# EasyEDA Pro project sucaiku.eprj

# Schematic Schematic1

## Sheets
1 POWER: Board Name: Board1; Create Date: 2025-07-08; Page Name: POWER; Project Name: sucaiku-20250721; Schematic Name: Schematic1; Update Date: 2025-07-08; Company: 嘉立创EDA; Page Size: A4; Version: V1.0
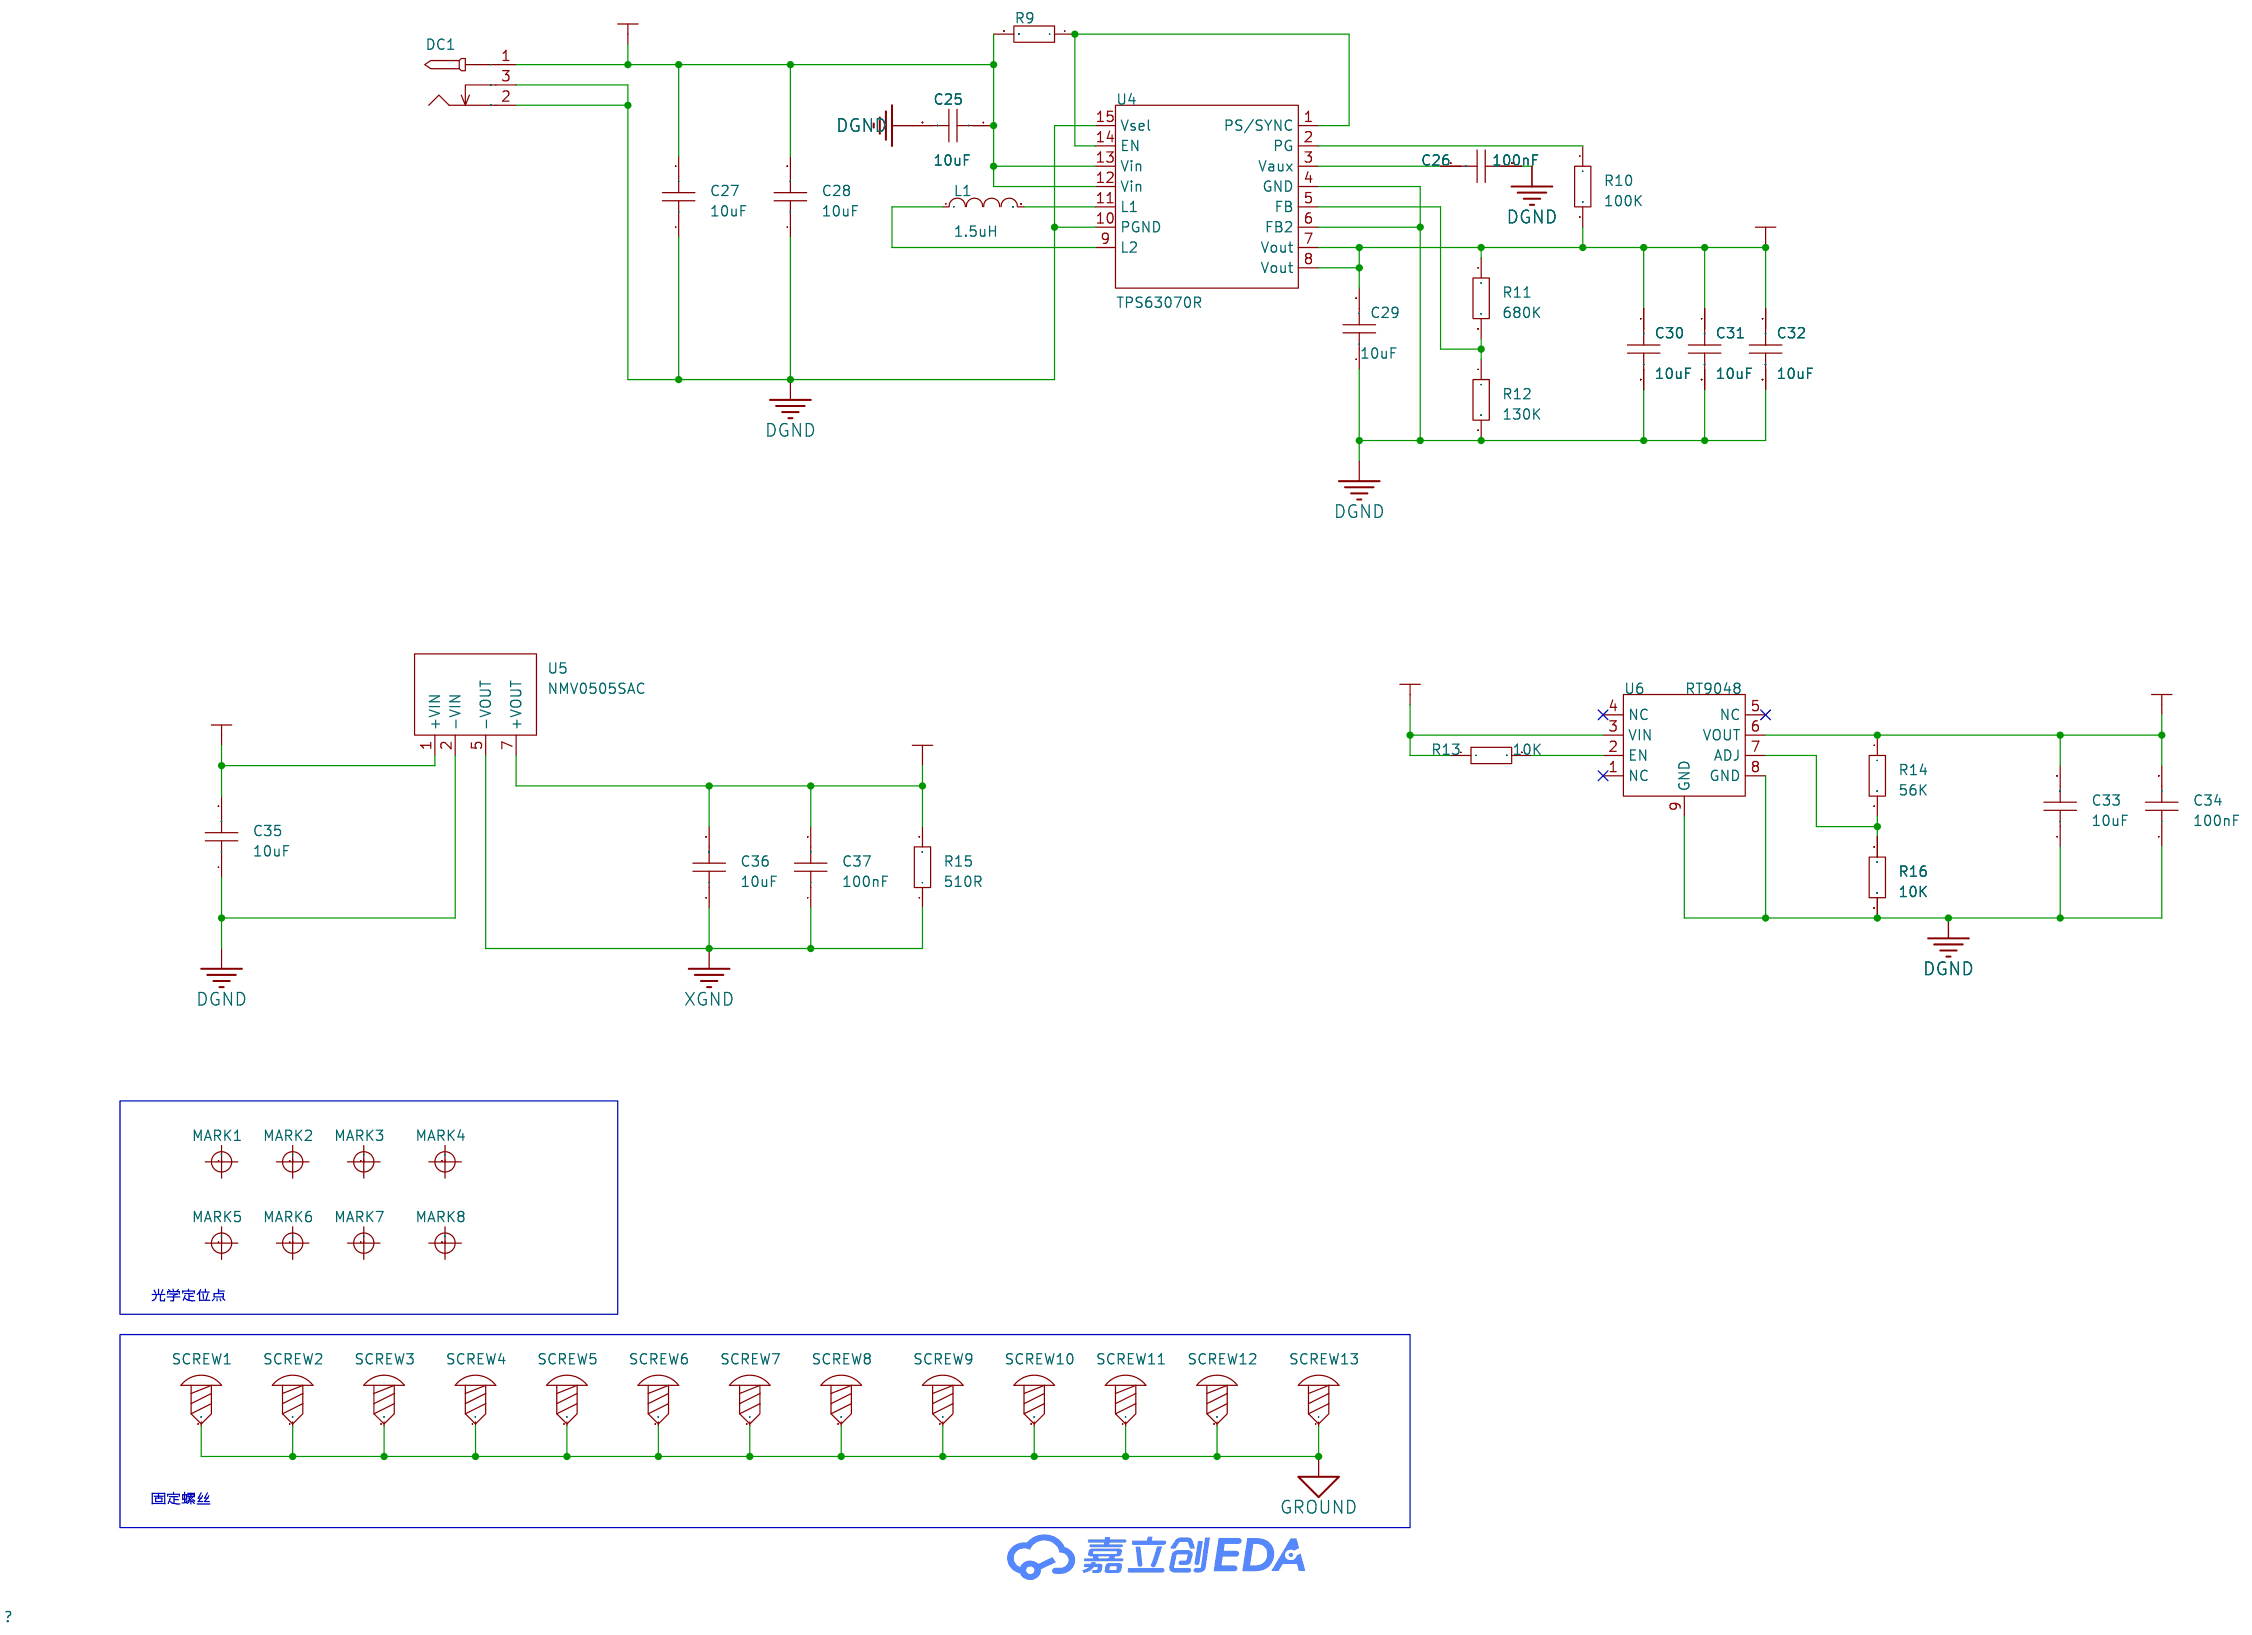
[diagram p0: POWER]
2 MCU: Page Name: MCU; Update Date: 2025-07-21
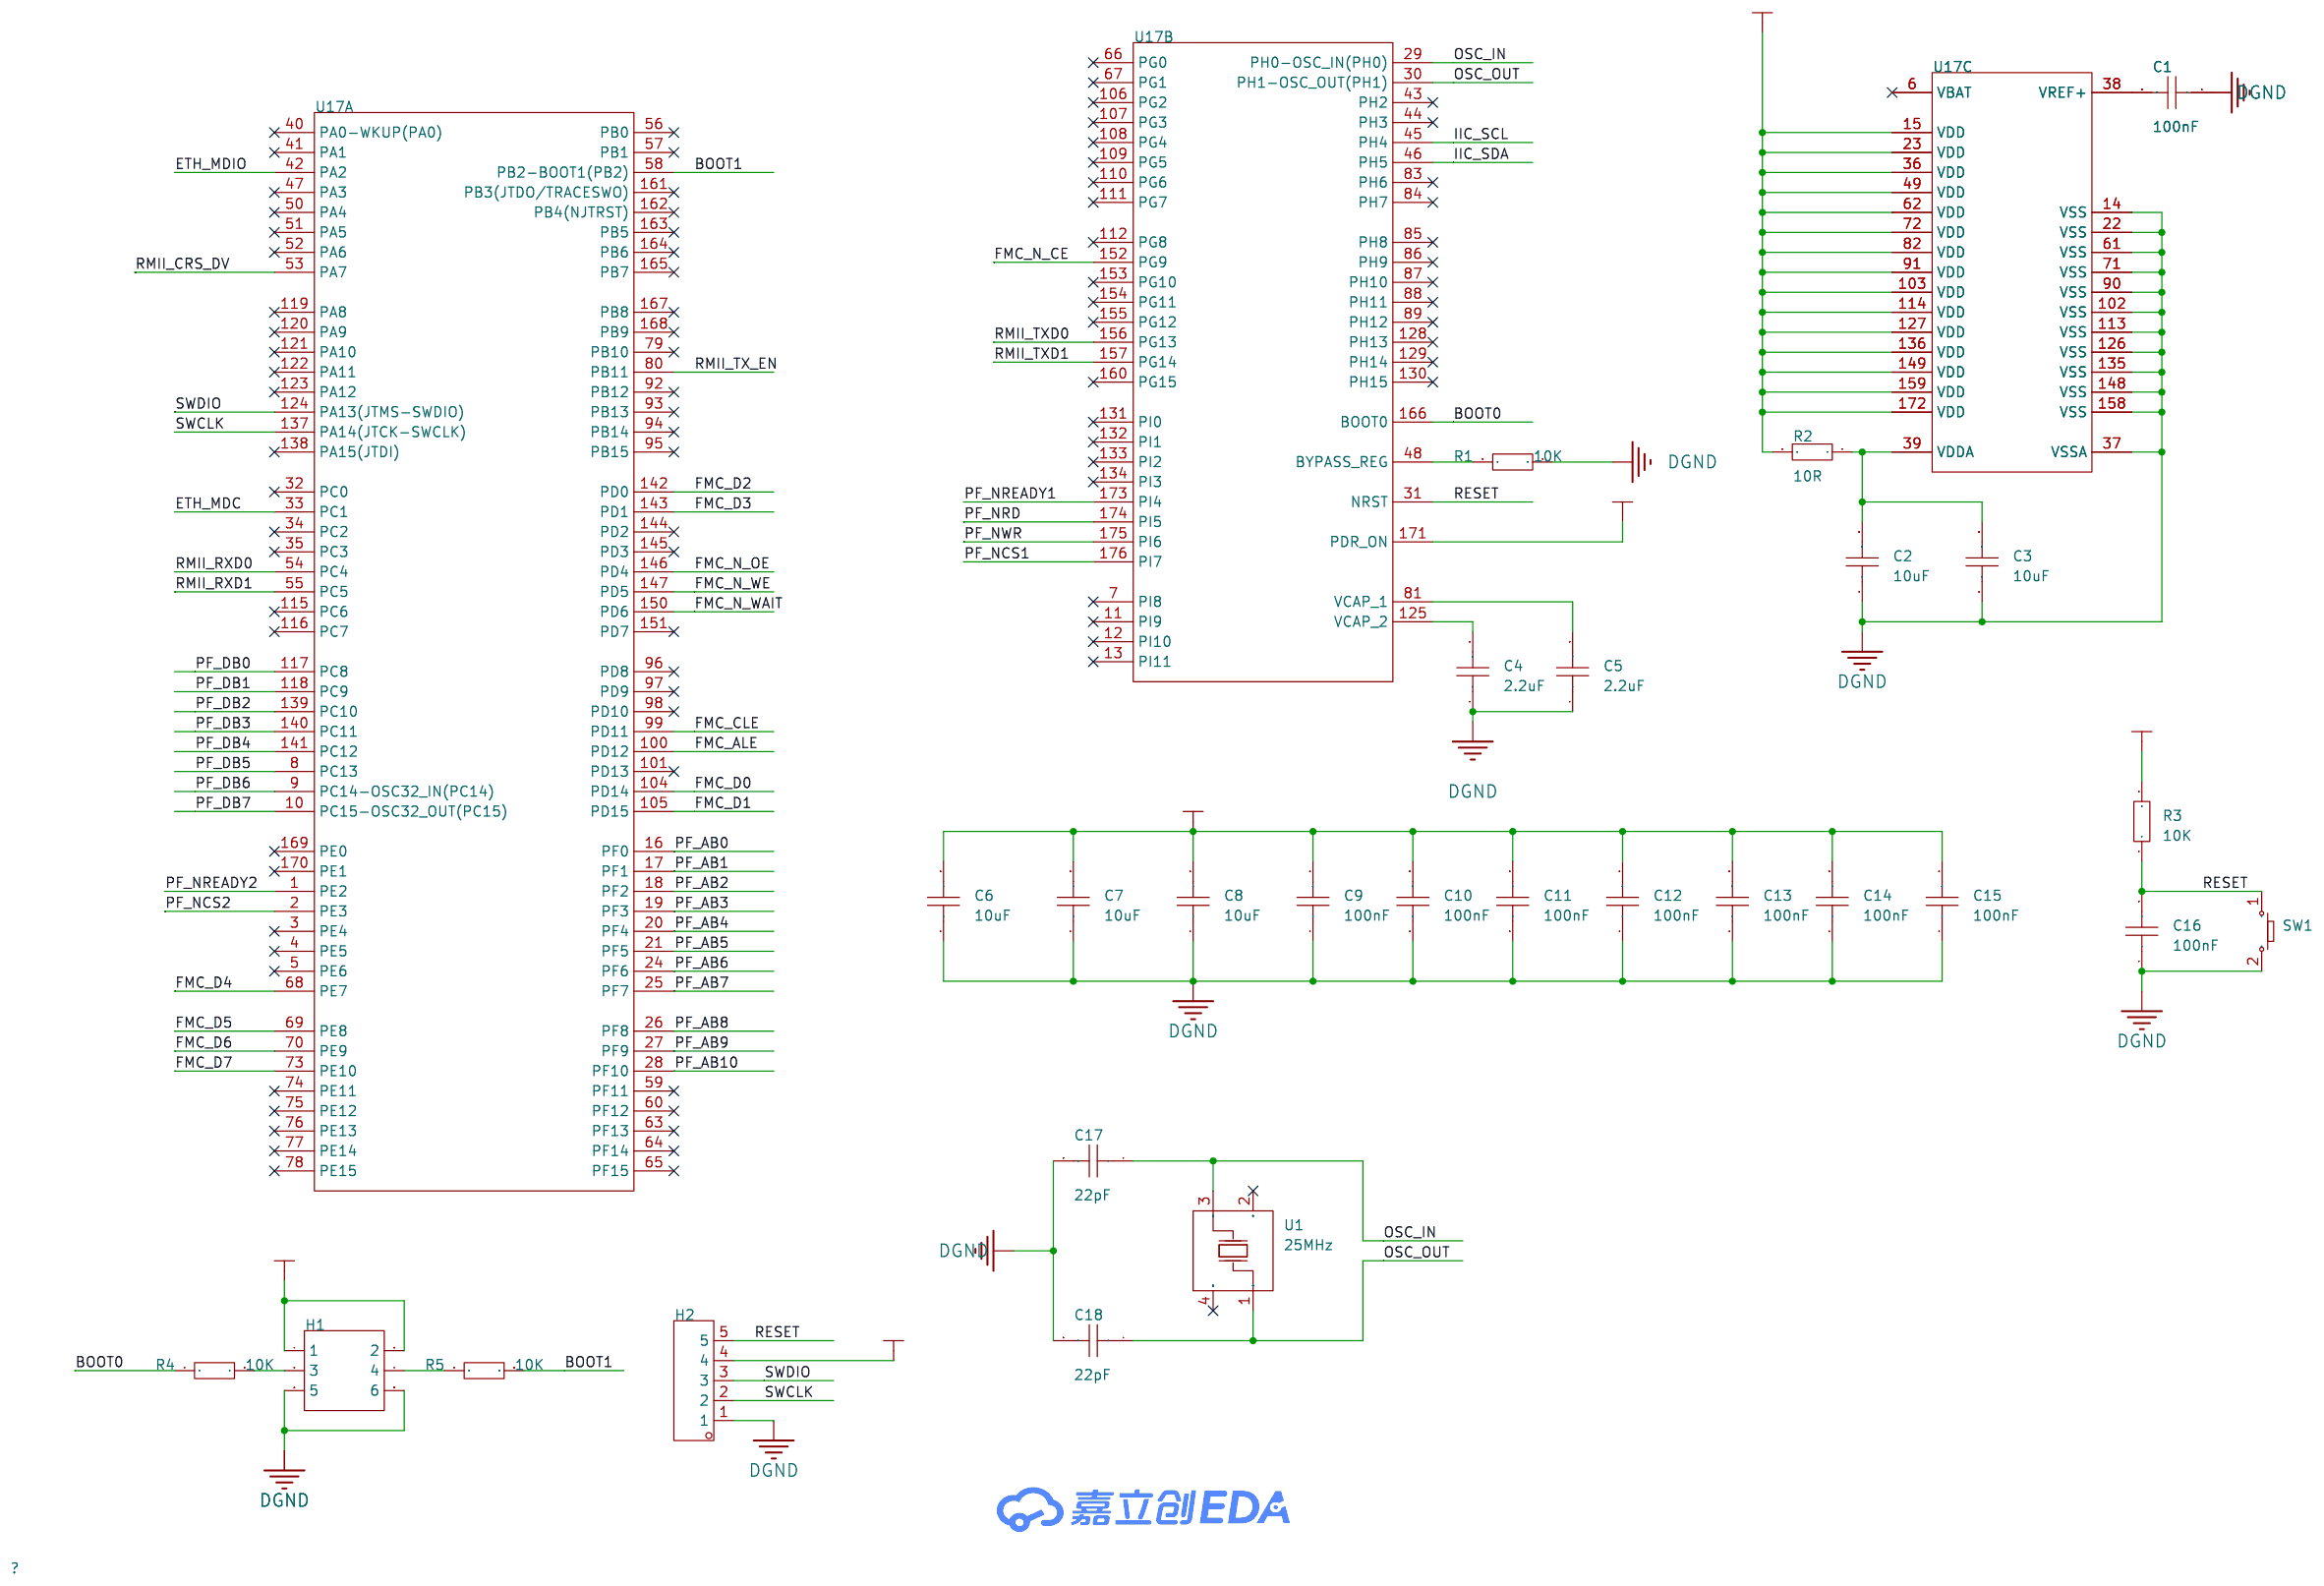
[diagram p1: MCU]
3 PROFIBUS1: Page Name: PROFIBUS1; Update Date: 2025-07-21
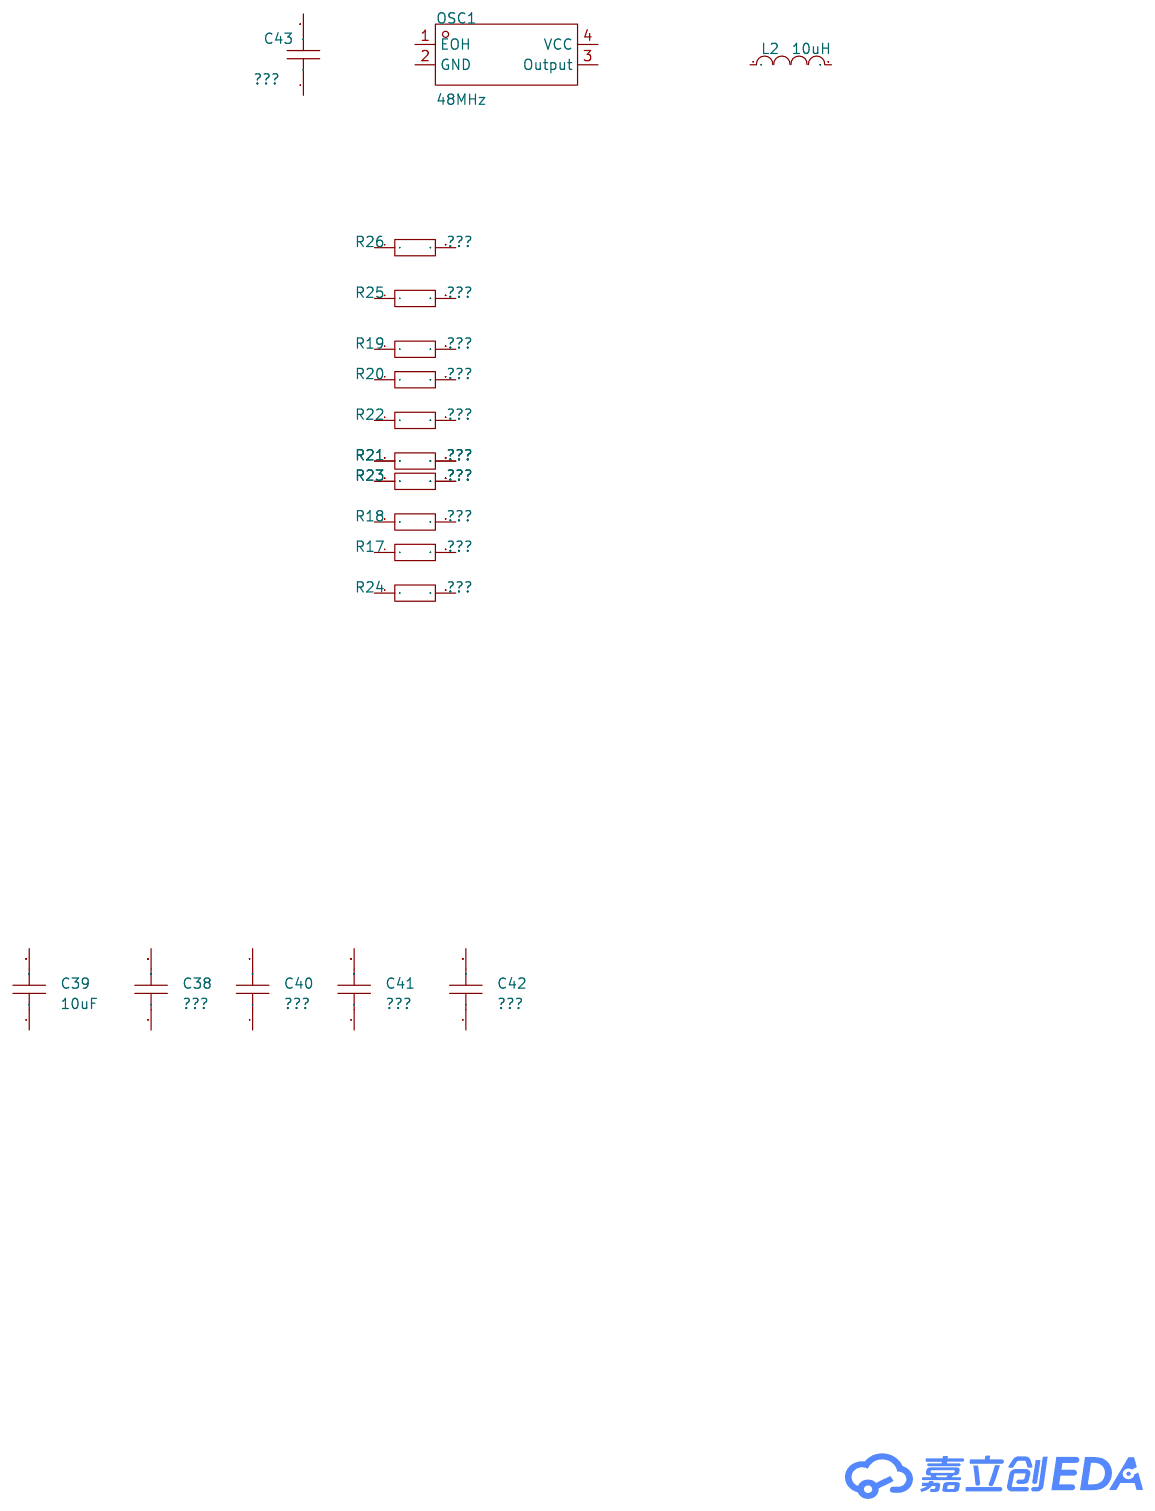
[diagram p2: PROFIBUS1]
4 ETHERNET: Page Name: ETHERNET
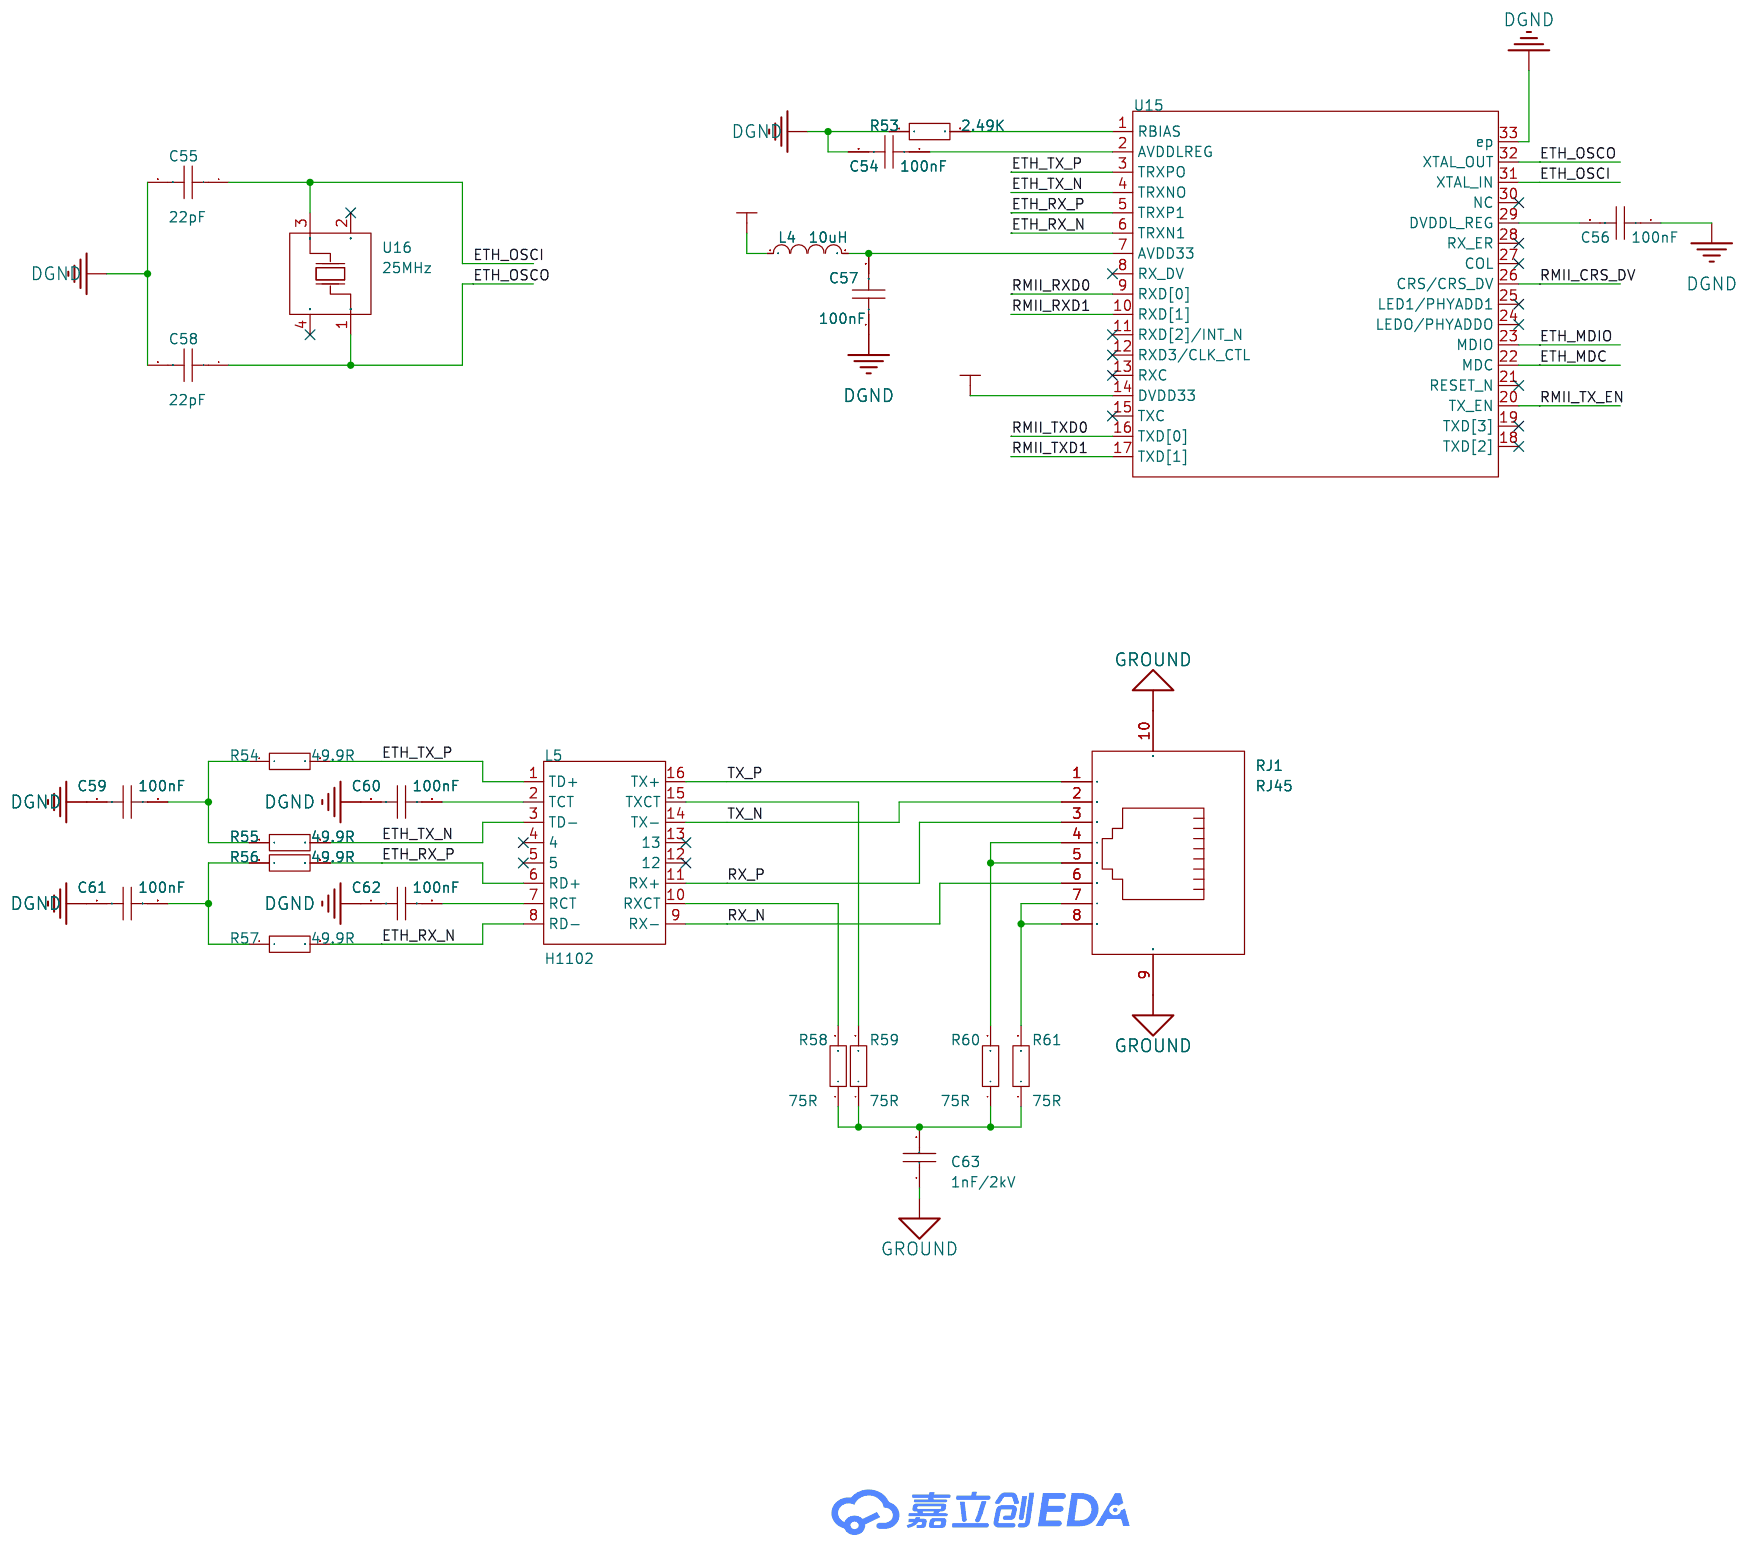
[diagram p3: ETHERNET]
5 MEMORY: Page Name: MEMORY
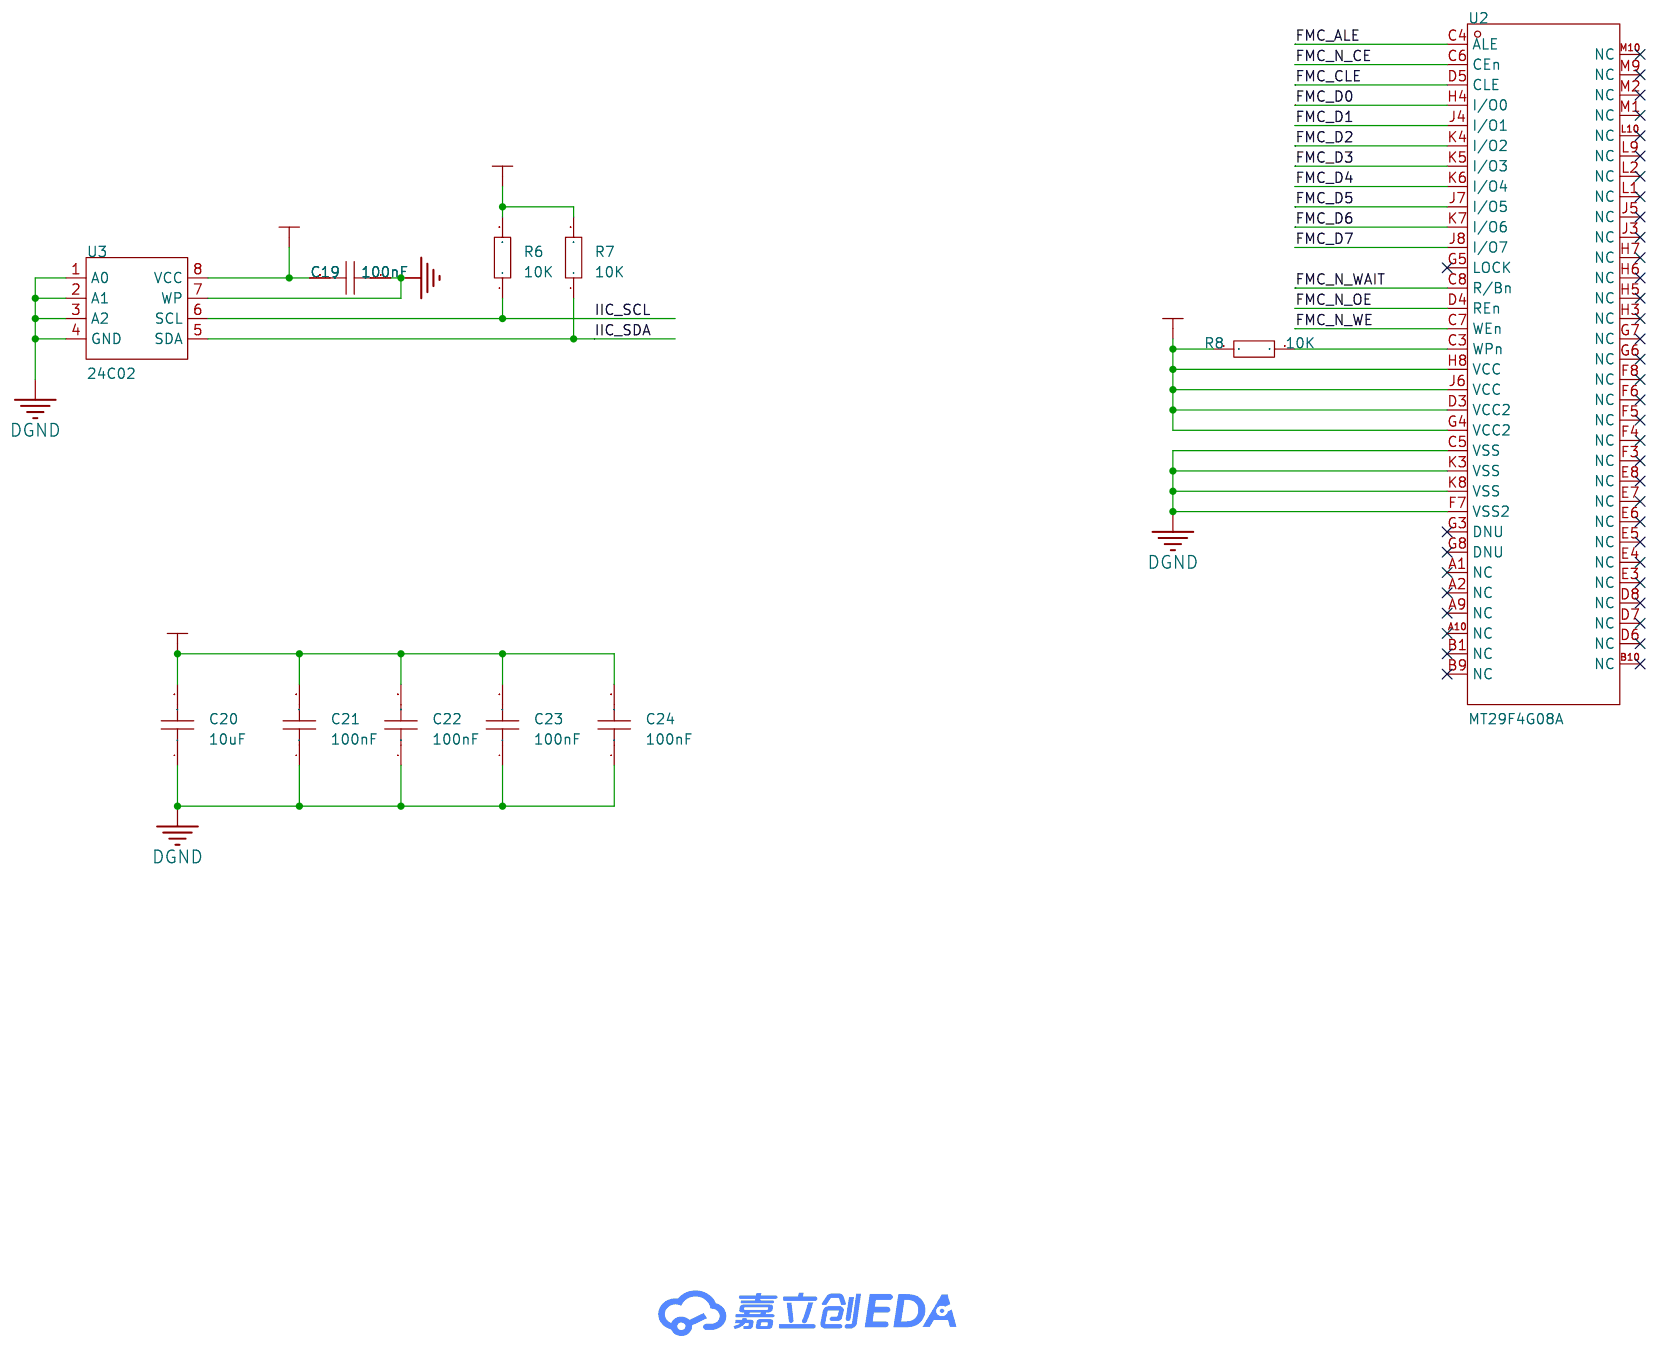
[diagram p4: MEMORY]
6 PROFIBUS2: Page Name: PROFIBUS2
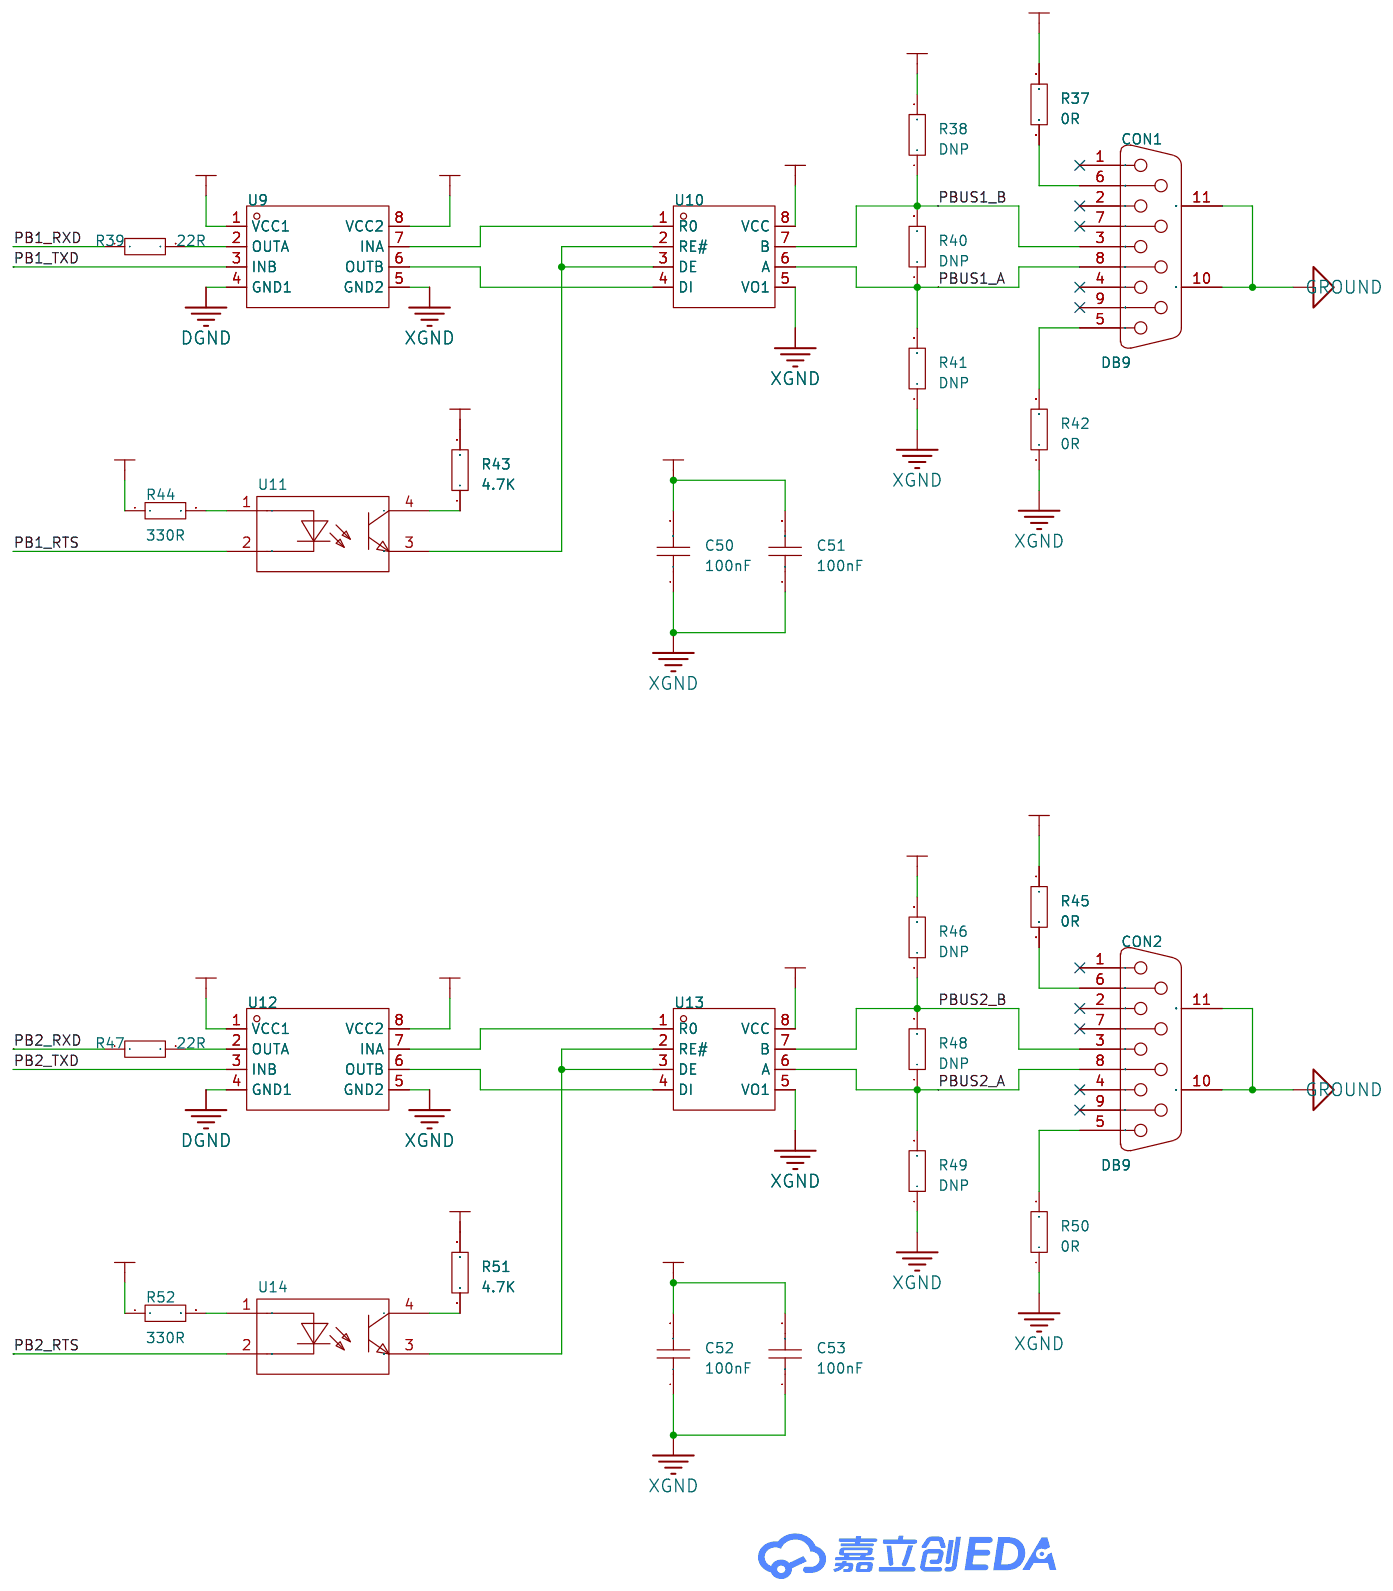
[diagram p5: PROFIBUS2]

## Parts
sheet ETHERNET
C54  100nF  [C0402]
C55  22pF  [C0402]
C56  100nF  [C0402]
C57  100nF  [C0402]
C58  22pF  [C0402]
C59  100nF  [C0603]
C60  100nF  [C0603]
C61  100nF  [C0603]
C62  100nF  [C0603]
C63  1nF/2kV  [C1206]
L4  10uH  [L0402]
L5  H1102  [XFMR-SMD_H1102N]
R53  2.49K  [R0603]
R54  49.9R  [R0603]
R55  49.9R  [R0603]
R56  49.9R  [R0603]
R57  49.9R  [R0603]
R58  75R  [R0603]
R59  75R  [R0603]
R60  75R  [R0603]
R61  75R  [R0603]
RJ1  RJ45  [RJ45-TH_R-RJ45R10P-B000-1]
U15  YT8512C  [QFN-32_L5.0-W5.0-P0.50-BL-EP3.4]
U16  25MHz  [CRYSTAL-SMD_4P-L3.2-W2.5-TR]
sheet MCU
C1  100nF  [C0402]
C2  10uF  [C0603]
C3  10uF  [C0603]
C4  2.2uF  [C0402]
C5  2.2uF  [C0402]
C6  10uF  [C0603]
C7  10uF  [C0603]
C8  10uF  [C0603]
C9  100nF  [C0402]
C10  100nF  [C0402]
C11  100nF  [C0402]
C12  100nF  [C0402]
C13  100nF  [C0402]
C14  100nF  [C0402]
C15  100nF  [C0402]
C16  100nF  [C0402]
C17  22pF  [C0402]
C18  22pF  [C0402]
H1  -  [HDR-TH_6P-P2.54-V-R2-C3-S2.54_A2541WV-2X3P]
H2  -  [HDR-TH_5P-P2.54-V-M]
R1  10K  [R0402]
R2  10R  [R0402]
R3  10K  [R0402]
R4  10K  [R0402]
R5  10K  [R0402]
SW1  -  [Key_SMD_3x4x2]
U1  25MHz  [CRYSTAL-SMD_4P-L3.2-W2.5-TR]
U17  STM32F429IGT6  [LQFP-176_L24.0-W24.0-P0.50-LS26.0-BL]  (sections 1,2,3)
sheet MEMORY
C19  100nF  [C0402]
C20  10uF  [C0603]
C21  100nF  [C0402]
C22  100nF  [C0402]
C23  100nF  [C0402]
C24  100nF  [C0402]
R6  10K  [R0402]
R7  10K  [R0402]
R8  10K  [R0402]
U2  MT29F4G08A  [VFBGA-63_L11.0-W9.0-P0.80-BL_MT29F2G08ABAEAH4-IT-E]
U3  24C02  [SOP-8_L4.9-W3.9-P1.27-LS6.0-BL]
sheet POWER
C25  10uF  [C0603]
C26  100nF  [C0603]
C27  10uF  [C0805]
C28  10uF  [C0805]
C29  10uF  [C0603]
C30  10uF  [C0805]
C31  10uF  [C0805]
C32  10uF  [C0805]
C33  10uF  [C0603]
C34  100nF  [C0402]
C35  10uF  [C0603]
C36  10uF  [C0603]
C37  100nF  [C0402]
DC1  -  [DC-005_2.5]
L1  1.5uH  [IND-SMD_L4.0-W4.0_FNR40XXS]
MARK1  -  [Mark-Point-1mm]  (no BOM)
MARK2  -  [Mark-Point-1mm]  (no BOM)
MARK3  -  [Mark-Point-1mm]  (no BOM)
MARK4  -  [Mark-Point-1mm]  (no BOM)
MARK5  -  [Mark-Point-1mm]  (no BOM)
MARK6  -  [Mark-Point-1mm]  (no BOM)
MARK7  -  [Mark-Point-1mm]  (no BOM)
MARK8  -  [Mark-Point-1mm]  (no BOM)
R9  10K  [R0603]
R10  100K  [R0603]
R11  680K  [R0603]
R12  130K  [R0603]
R13  10K  [R0402]
R14  56K  [R0402]
R15  510R  [R1206]
R16  10K  [R0402]
SCREW1  -  [M3螺丝]
SCREW2  -  [M3螺丝]
SCREW3  -  [M3螺丝]
SCREW4  -  [M3螺丝]
SCREW5  -  [M3螺丝]
SCREW6  -  [M3螺丝]
SCREW7  -  [M3螺丝]
SCREW8  -  [M3螺丝]
SCREW9  -  [M3螺丝]
SCREW10  -  [M3螺丝]
SCREW11  -  [M3螺丝]
SCREW12  -  [M3螺丝]
SCREW13  -  [M3螺丝]
U4  TPS63070R  [VQFN-HR-15_L3.0-W2.5-P0.50-BL_TPS63070RNMR]
U5  NMV0505SAC  [PWRM-TH_4P-L19.5-W6.0-P2.54_NMV0505SAC]
U6  RT9048  [ESOP-8_L4.9-W3.9-P1.27-LS6.0-BL-EP]
sheet PROFIBUS1
C38  ???  [C0402]
C39  10uF  [C0603]
C40  ???  [C0402]
C41  ???  [C0402]
C42  ???  [C0402]
C43  ???  [C0402]
L2  10uH  [L0402]
OSC1  48MHz  [OSC-SMD_4P-L2.0-W1.6-BL]
R17  ???  [R0402]
R18  ???  [R0402]
R19  ???  [R0402]
R20  ???  [R0402]
R21  ???  [R0402]
R22  ???  [R0402]
R23  ???  [R0402]
R24  ???  [R0402]
R25  ???  [R0402]
R26  ???  [R0402]
sheet PROFIBUS2
C50  100nF  [C0402]
C51  100nF  [C0402]
C52  100nF  [C0402]
C53  100nF  [C0402]
CON1  DB9  [DB9-TH_DT10121-M5N3-4F]
CON2  DB9  [DB9-TH_DT10121-M5N3-4F]
R37  0R  [R0805]
R38  DNP  [R0805]
R39  22R  [R0402]
R40  DNP  [R0805]
R41  DNP  [R0805]
R42  0R  [R0805]
R43  4.7K  [R0402]
R44  330R  [R0402]
R45  0R  [R0805]
R46  DNP  [R0805]
R47  22R  [R0402]
R48  DNP  [R0805]
R49  DNP  [R0805]
R50  0R  [R0805]
R51  4.7K  [R0402]
R52  330R  [R0402]
U9  ISO7221AD  [SOIC-8_L5.0-W4.0-P1.27-LS6.0-BL]
U10  RS485  [SOP-8_L4.9-W3.9-P1.27-LS6.0-BL]
U11  TLP781(GR-TP6,F)  [SOP-4_L6.5-W4.6-P2.54-LS10.3-TL]
U12  ISO7221AD  [SOIC-8_L5.0-W4.0-P1.27-LS6.0-BL]
U13  RS485  [SOP-8_L4.9-W3.9-P1.27-LS6.0-BL]
U14  TLP781(GR-TP6,F)  [SOP-4_L6.5-W4.6-P2.54-LS10.3-TL]

## Library data of the parts
C1 C4 C5 C9-C19 C21-C24 C34 C37 C38 C40-C43 C50-C58 = CAP_0402: Supplier Footprint: 0402
C2 C3 C6-C8 C20 C25 C26 C29 C33 C35 C36 C39 C59-C62 = CAP_0603: Supplier Footprint: 0603
C63 = 1206B102K202NT: 容值:1nF;精度:±10%;额定电压:2kV;温度系数:X7R;; LCSC Part Name: 1nF ±10% 2kV; Supplier Part: C9196; Manufacturer: FH(风华); Supplier Footprint: 1206; JLCPCB Part Class: 基础库; Datasheet: https://atta.szlcsc.com/upload/public/pdf/source/20200305/C486355_26A10D38EF8C2A5C37091D0039909270.pdf; Supplier: LCSC; Tolerance: ±10%; Voltage Rating: 2kV; Temperature Coefficient: X7R
L2 L4 = L_0402
L5 = H1102N: 匝数比:1:1;端口数量:单口;速率:100M;功能(POE或非POE):POE;; Supplier Part: C42418465; Manufacturer: CND-tek(磁联达); Supplier Footprint: SMD-16P,12.7x7mm; JLCPCB Part Class: 扩展库; Datasheet: https://atta.szlcsc.com/upload/public/pdf/source/20241220/FA2FD30D73A30CAF74C6B0D68E33E6ED.pdf; Supplier: LCSC; Turns Ratio: 1:1; Number of Channels: 单口; rate: 100M; Function: POE; Isolation Voltage(Vrms): 1.5kV; operating temperature: -40℃~+85℃
R9-R12 R53-R61 = Res_0603: Supplier Footprint: 0603
RJ1 = RJ45-9758-1: Supplier Part: C9900001262; Supplier Footprint: RJ45-TH_R-RJ45R10P-B000; JLCPCB Part Class: 扩展库; Supplier: LCSC
U15 = YT8512C: Supplier Part: C9900015586; Supplier Footprint: QFN-32-EP(5x5); JLCPCB Part Class: 扩展库; Supplier: LCSC
U1 U16 = 25MHz: Supplier Part: C2914306; Supplier Footprint: SMD-4P; JLCPCB Part Class: 扩展库; Supplier: LCSC
H1 = HDR-M_2.54_2x3: Supplier Part: C402781; Supplier Footprint: 插件,P=2.54mm
H2 = HDR-M_2.54_1x5P: Supplier Part: C358687; Supplier Footprint: 插件
R1-R8 R13 R14 R16-R26 R39 R43 R44 R47 R51 R52 = Res_0402: Supplier Footprint: 0402
SW1 = Key_SMD_3x4x2: Supplier Footprint: SMD
U17 = STM32F429IGT6: CPU内核:ARM-M4;CPU最大主频:180MHz;应用领域:-;; LCSC Part Name: 带DSP和FPU的高性能高级系列ARM Cortex-M4 MCU，具有1 MB Flash、180 MHz CPU、ART加速器、Chrom-ART加速器、TFT、带SDRAM的FMC和TFT; Supplier Part: C54328; Manufacturer: ST(意法半导体); Supplier Footprint: LQFP-176(24x24); JLCPCB Part Class: 扩展库; Datasheet: https://atta.szlcsc.com/upload/public/pdf/source/20170102/1483323670635.pdf; Supplier: LCSC; CPU Core: ARM-M4; CPU Maximum Speed: 180MHz; Program Storage Size: 1MB; Program Memory Type: FLASH; Number of I/O: 140; ADC (Bit): 12bit; DAC (Bit): 12bit; Voltage - Supply: 1.8V~3.6V
U2 = MT29F4G08A
U3 = 24C02: 24C02是电可擦除PROM，采用256x8-bit的组织架构，具有页写能力，每页为8字节。支持I2C总线传输协议，工作电压范围1.8V~5.5V，擦写寿命100万次，数据保持时间100年。; LCSC Part Name: 24C02串行I2C总线EEPROM 停产; Supplier Part: C2984961; Manufacturer: HX(恒佳兴); Supplier Footprint: SOP-8; JLCPCB Part Class: 扩展库; Datasheet: https://atta.szlcsc.com/upload/public/pdf/source/20220328/EEDD5B560A30EF54D50A97B6296179D0.pdf; Supplier: LCSC
C27 C28 C30-C32 = CAP_0805: Supplier Footprint: 0805
DC1 = DC-005_2.5: Supplier Footprint: 插件
L1 = FNR4020S1R5MT: 电感值:1.5uH;精度:±20%;额定电流:3A;饱和电流(Isat):4.9A;; LCSC Part Name: 1.5uH ±20% 4.9A; Supplier Part: C167824; Manufacturer: cjiang(长江微电); Supplier Footprint: SMD,4x4mm; JLCPCB Part Class: 扩展库; Datasheet: https://atta.szlcsc.com/upload/public/pdf/source/20190327/C167925_9EFF0AABC4CA629C2CC95961DBF7D39D.pdf; Supplier: LCSC; Tolerance: ±20%; Rated Current: 3A; Saturation Current (Isat): 4.9A; DC Resistance (DCR): 46mΩ
MARK1-MARK8 = Mark-Point: Mark点
R15 = Res_1206: Supplier Footprint: 1206
SCREW1-SCREW13 = M3螺丝: Supplier Footprint: 插件
U4 = TPS63070RNMR: 功能类型:升降压型;输出类型:可调;工作电压:2V~16V;输出电压:2.5V~9V;输出电流:-;; LCSC Part Name: 2V 至 16V 3.6A 降压-升压转换器; Supplier Part: C109322; Manufacturer: TI(德州仪器); Supplier Footprint: VQFN-15-HR(2.5x3); JLCPCB Part Class: 扩展库; Datasheet: https://www.ti.com/cn/lit/gpn/tps63070; Supplier: LCSC; Function: 升降压型; Output Type: 可调; Voltage - Supply: 2V~16V; Output Voltage: 2.5V~9V; Frequency - Switching: 2.4MHz; Operating Temperature: -40℃~+125℃@(TJ); Synchronous Rectifier: 是; Number of Outputs: 1; Topology: 降压-升压式; Switch tube (built-in/external): 内置
U5 = NMV0505SAC: Supplier Part: C22403511; Manufacturer: muRata(村田); Supplier Footprint: SIP,19.5x9.8mm; JLCPCB Part Class: 扩展库; Datasheet: https://atta.szlcsc.com/upload/public/pdf/source/20250221/3501F2CBD61B06B1107EA0847EB93684.pdf; Supplier: LCSC
U6 = RT9048GSP: 输出类型:可调;最大输入电压:6V;输出电压:500mV~5.4V;输出电流:2A;输出极性:正极;; Supplier Part: C2983594; Manufacturer: RICHTEK(立锜); Supplier Footprint: SOIC-8; JLCPCB Part Class: 扩展库; Datasheet: https://atta.szlcsc.com/upload/public/pdf/source/20220322/BA86CA3589B2E959B771869429761AE3.pdf; Supplier: LCSC; Output Type: 可调; Maximum Input Voltage: 6V; Output Voltage: 500mV~5.4V; Output Current: 2A; Dropout Voltage: 600mV@(2A); standby current: 700uA; Feature: 防静电保护；短路保护；低ESR；热保护(TSD)；欠压闭锁；过流保护(OCP)；带使能; Operating Temperature: -40℃~+85℃@(Ta); Output Polarity: 正极; Number of Outputs: 1
OSC1 = CA20C4805INT: 频率:48MHz;输出模式:HCMOS；TTL;工作电压:2.5V;供电电流:15mA;; Supplier Part: C1990976; Manufacturer: CTS(西迪斯); Supplier Footprint: SMD2016-4P; JLCPCB Part Class: 扩展库; Datasheet: https://atta.szlcsc.com/upload/public/pdf/source/20210702/BDFC52EAD60C3547BAEE0A1F7A9586ED.pdf; Supplier: LCSC; Output Type: HCMOS；TTL; Supply Voltage: 2.5V; Supply Current (Max): 15mA; Operating Temperature: -40℃~+85℃
CON1 CON2 = DB9 TH90: Supplier Part: C9900003919; Supplier Footprint: DB9公头-90; JLCPCB Part Class: 扩展库; Supplier: LCSC
R37 R38 R40-R42 R45 R46 R48-R50 = Res_0805: Supplier Footprint: 0805
U9 U12 = ISO7221AD: ISO7221A 双通道、TTL、1/1、1Mbps 数字隔离器; Supplier Part: C553112; Manufacturer: TI(德州仪器); Supplier Footprint: SOIC-8; JLCPCB Part Class: 扩展库; Datasheet: https://www.ti.com/cn/lit/gpn/iso7220b; Supplier: LCSC; Number of Forward Channels: 1; Number of Reverse Channels: 1; Data Rate(Max): 1Mbps; Default Output: 高电平; Isolation Voltage(Vrms): 2500; CMTI(kV/us): 50kV/us; Operating Temperature: -40℃~+125℃
U10 U13 = RS485: Supplier Part: C19631832; Manufacturer: GR(国睿); Supplier Footprint: SOP-8; JLCPCB Part Class: 扩展库; Datasheet: https://atta.szlcsc.com/upload/public/pdf/source/20231222/19355B4F599D508D138DCE4BEFC5C1F8.pdf; Supplier: LCSC
U11 U14 = TLP781(GR-TP6,F): 输入电压类型:DC;正向压降(Vf):1.15V;输出电流:50mA;隔离电压(Vrms):5kV;反向电压:5V;负载电压:80V;输出通道数:1;集射极饱和电压(VCE(sat)):400mV@2.4mA,8mA;; LCSC Part Name: DC输入 隔离电压(rms):5000V 停产; Supplier Part: C58371; Manufacturer: TOSHIBA(东芝); Supplier Footprint: SOP-4-2.54mm; JLCPCB Part Class: 扩展库; Datasheet: https://atta.szlcsc.com/upload/public/pdf/source/20151024/1457707494556.pdf; Supplier: LCSC; Input voltage type: DC; Output Type: 光电三极管; Forward Voltage: 1.15V; Output Current: 50mA; Isolation Voltage(rms): 5kV; Reverse Voltage: 5V; Load Voltage: 80V; Number of Outputs: 1; Collector-Emitter Saturation Voltage (Vce(sat)@Ic,IF): 400mV@2.4mA,8mA; Rise time: 2us@2mA,100Ω; Fall time: 3us@2mA,100Ω; Operating Temperature: -55℃~+110℃

## Nets
DGND: C1.1 C2.1 C3.1 C4.1 C5.1 C6.1 C7.1 C8.1 C9.1 C10.1 C11.1 C12.1 C13.1 C14.1 C15.1 C16.1 C17.2 C18.2 C19.1 C20.1 C21.1 C22.1 C23.1 C24.1 C25.2 C26.2 C27.1 C28.1 C29.1 C30.2 C31.2 C32.2 C33.1 C34.1 C35.1 C54.2 C55.2 C56.1 C57.1 C58.2 C59.1 C60.1 C61.1 C62.1 DC1.2 DC1.3 H1.5 H1.6 H2.1 R1.1 R12.2 R16.2 R53.1 SW1.2 U2.C5(VSS) U2.F7(VSS2) U2.K3(VSS) U2.K8(VSS) U3.1(A0) U3.2(A1) U3.3(A2) U3.4(GND) U3.7(WP) U4.4(GND) U4.6(FB2) U4.10(PGND) U4.15(Vsel) U5.2(-VIN) U6.8(GND) U6.9(GND) U9.4(GND1) U12.4(GND1) U15.33(ep) U17.14(VSS) U17.22(VSS) U17.37(VSSA) U17.61(VSS) U17.71(VSS) U17.90(VSS) U17.102(VSS) U17.113(VSS) U17.126(VSS) U17.135(VSS) U17.148(VSS) U17.158(VSS)
VCC33V: C6.2 C7.2 C8.2 C9.2 C10.2 C11.2 C12.2 C13.2 C14.2 C15.2 C19.2 C20.2 C21.2 C22.2 C23.2 C24.2 C33.2 C34.2 H1.1 H1.2 H2.4 L4.1 R2.2 R3.2 R6.2 R7.2 R8.1 R14.1 R44.1 R52.1 U2.D3(VCC2) U2.G4(VCC2) U2.H8(VCC) U2.J6(VCC) U3.8(VCC) U6.6(VOUT) U9.1(VCC1) U12.1(VCC1) U15.14(DVDD33) U17.15(VDD) U17.23(VDD) U17.36(VDD) U17.49(VDD) U17.62(VDD) U17.72(VDD) U17.82(VDD) U17.91(VDD) U17.103(VDD) U17.114(VDD) U17.127(VDD) U17.136(VDD) U17.149(VDD) U17.159(VDD) U17.171(PDR_ON) U17.172(VDD)
VDD50V: C29.2 C30.1 C31.1 C32.1 C35.2 R10.2 R11.1 R13.1 U4.7(Vout) U4.8(Vout) U5.1(+VIN) U6.3(VIN)
VIN12V: C25.1 C27.2 C28.2 DC1.1(4) R9.2 U4.12(Vin) U4.13(Vin)
BOOT0: R4.1 U17.166(BOOT0)
BOOT1: R5.2 U17.58(PB2-BOOT1(PB2))
ETH_MDC: U15.22(MDC) U17.33(PC1)
ETH_MDIO: U15.23(MDIO) U17.42(PA2)
ETH_OSCI: C55.1 U15.31(XTAL_IN) U16.3(OSC2)
ETH_OSCO: C58.1 U15.32(XTAL_OUT) U16.1(OSC1)
ETH_RX_N: L5.8(RD-) R57.2 U15.6(TRXN1)
ETH_RX_P: L5.6(RD+) R56.2 U15.5(TRXP1)
ETH_TX_N: L5.3(TD-) R55.2 U15.4(TRXNO)
ETH_TX_P: L5.1(TD+) R54.2 U15.3(TRXPO)
FMC_ALE: U2.C4(ALE) U17.100(PD12)
FMC_CLE: U2.D5(CLE) U17.99(PD11)
FMC_D0: U2.H4(I/O0) U17.104(PD14)
FMC_D1: U2.J4(I/O1) U17.105(PD15)
FMC_D2: U2.K4(I/O2) U17.142(PD0)
FMC_D3: U2.K5(I/O3) U17.143(PD1)
FMC_D4: U2.K6(I/O4) U17.68(PE7)
FMC_D5: U2.J7(I/O5) U17.69(PE8)
FMC_D6: U2.K7(I/O6) U17.70(PE9)
FMC_D7: U2.J8(I/O7) U17.73(PE10)
FMC_N_CE: U2.C6(CEn) U17.152(PG9)
FMC_N_OE: U2.D4(REn) U17.146(PD4)
FMC_N_WAIT: U2.C8(R/Bn) U17.150(PD6)
FMC_N_WE: U2.C7(WEn) U17.147(PD5)
GROUND: C63.1 CON1.10(MH1) CON1.11(MH2) CON2.10(MH1) CON2.11(MH2) RJ1.9 RJ1.10 SCREW1.1 SCREW2.1 SCREW3.1 SCREW4.1 SCREW5.1 SCREW6.1 SCREW7.1 SCREW8.1 SCREW9.1 SCREW10.1 SCREW11.1 SCREW12.1 SCREW13.1
IIC_SCL: R6.1 U3.6(SCL) U17.45(PH4)
IIC_SDA: R7.1 U3.5(SDA) U17.46(PH5)
OSC_IN: C17.1 U1.3(OSC2) U17.29(PH0-OSC_IN(PH0))
OSC_OUT: C18.1 U1.1(OSC1) U17.30(PH1-OSC_OUT(PH1))
PB1_RTS: U11.2
PB1_RXD: R39.1
PB1_TXD: U9.3(INB)
PB2_RTS: U14.2
PB2_RXD: R47.1
PB2_TXD: U12.3(INB)
PBUS1_A: CON1.8 R40.1 R41.2 U10.6(A)
PBUS1_B: CON1.3 R38.1 R40.2 U10.7(B)
PBUS2_A: CON2.8 R48.1 R49.2 U13.6(A)
PBUS2_B: CON2.3 R46.1 R48.2 U13.7(B)
PF_AB0: U17.16(PF0)
PF_AB1: U17.17(PF1)
PF_AB2: U17.18(PF2)
PF_AB3: U17.19(PF3)
PF_AB4: U17.20(PF4)
PF_AB5: U17.21(PF5)
PF_AB6: U17.24(PF6)
PF_AB7: U17.25(PF7)
PF_AB8: U17.26(PF8)
PF_AB9: U17.27(PF9)
PF_AB10: U17.28(PF10)
PF_DB0: U17.117(PC8)
PF_DB1: U17.118(PC9)
PF_DB2: U17.139(PC10)
PF_DB3: U17.140(PC11)
PF_DB4: U17.141(PC12)
PF_DB5: U17.8(PC13)
PF_DB6: U17.9(PC14-OSC32_IN(PC14))
PF_DB7: U17.10(PC15-OSC32_OUT(PC15))
PF_NCS1: U17.176(PI7)
PF_NCS2: U17.2(PE3)
PF_NRD: U17.174(PI5)
PF_NREADY1: U17.173(PI4)
PF_NREADY2: U17.1(PE2)
PF_NWR: U17.175(PI6)
RESET: C16.2 H2.5 R3.1 SW1.1 U17.31(NRST)
RMII_CRS_DV: U15.26(CRS/CRS_DV) U17.53(PA7)
RMII_RXD0: U15.9(RXD[0]) U17.54(PC4)
RMII_RXD1: U15.10(RXD[1]) U17.55(PC5)
RMII_TX_EN: U15.20(TX_EN) U17.80(PB11)
RMII_TXD0: U15.16(TXD[0]) U17.156(PG13)
RMII_TXD1: U15.17(TXD[1]) U17.157(PG14)
RX_N: L5.9(RX-) RJ1.6
RX_P: L5.11(RX+) RJ1.3
SWCLK: H2.2 U17.137(PA14(JTCK-SWCLK))
SWDIO: H2.3 U17.124(PA13(JTMS-SWDIO))
TX_N: L5.14(TX-) RJ1.2
TX_P: L5.16(TX+) RJ1.1
XGND: C36.1 C37.1 C50.1 C51.1 C52.1 C53.1 R15.1 R41.1 R42.1 R49.1 R50.1 U5.5(-VOUT) U9.5(GND2) U10.5(VO1) U12.5(GND2) U13.5(VO1)
XVDD50V: C36.2 C37.2 C50.2 C51.2 C52.2 C53.2 R15.2 R37.1 R38.2 R43.2 R45.1 R46.2 R51.2 U5.7(+VOUT) U9.8(VCC2) U10.8(VCC) U12.8(VCC2) U13.8(VCC)
$1N1437: R14.2 R16.1 U6.7(ADJ)
$1N1534: R13.2 U6.2(EN)
$1N4557: L1.2 U4.11(L1)
$1N4561: L1.1 U4.9(L2)
$1N4627: R9.1 U4.1(PS/SYNC) U4.14(EN)
$1N4907: R11.2 R12.1 U4.5(FB)
$1N4938: R10.1 U4.2(PG)
$1N5224: C26.1 U4.3(Vaux)
$2N3434: H1.4 R5.1
$2N3436: H1.3 R4.2
$2N4616: C2.2 C3.2 R2.1 U17.39(VDDA)
$2N5718: C4.2 U17.125(VCAP_2)
$2N5724: C5.2 U17.81(VCAP_1)
$2N5785: R1.2 U17.48(BYPASS_REG)
$2N5817: C1.2 U17.38(VREF+)
$4N1082: R61.2 RJ1.7 RJ1.8
$4N1097: R60.2 RJ1.4 RJ1.5
$4N1113: C63.2 R58.1 R59.1 R60.1 R61.1
$4N1174: L5.15(TXCT) R59.2
$4N1179: L5.10(RXCT) R58.2
$4N1564: C59.2 R54.1 R55.1
$4N1591: C60.2 L5.2(TCT)
$4N1728: C61.2 R56.1 R57.1
$4N1753: C62.2 L5.7(RCT)
$4N2458: R53.2 U15.1(RBIAS)
$4N2486: C54.1 U15.2(AVDDLREG)
$4N2594: C57.2 L4.2 U15.7(AVDD33)
$4N2671: C56.2 U15.29(DVDDL_REG)
$6N3313: R8.2 U2.C3(WPn)
$8N693: R39.2 U9.2(OUTA)
$8N697: R44.2 U11.1
$8N698: R43.1 U11.4
$8N699: U10.2(RE#) U10.3(DE) U11.3
$8N700: U9.6(OUTB) U10.4(DI)
$8N701: U9.7(INA) U10.1(R0)
$8N708: CON1.5 R42.2
$8N709: CON1.6 R37.2
$8N1696: R47.2 U12.2(OUTA)
$8N1700: R52.2 U14.1
$8N1701: R51.1 U14.4
$8N1702: U13.2(RE#) U13.3(DE) U14.3
$8N1703: U12.6(OUTB) U13.4(DI)
$8N1704: U12.7(INA) U13.1(R0)
$8N1711: CON2.5 R50.2
$8N1712: CON2.6 R45.2

Not connected (* = marked no-connect by the designer): C38 1 2; C39 1 2; C40 1 2; C41 1 2; C42 1 2; C43 1 2; CON1 1* 2* 4* 7* 9*; CON2 1* 2* 4* 7* 9*; L2 1 2; L5 4* 5* 12* 13*; MARK1 1; MARK2 1; MARK3 1; MARK4 1; MARK5 1; MARK6 1; MARK7 1; MARK8 1; OSC1 1(EOH) 2(GND) 3(Output) 4(VCC); R17 1 2; R18 1 2; R19 1 2; R20 1 2; R21 1 2; R22 1 2; R23 1 2; R24 1 2; R25 1 2; R26 1 2; U1 2(GND)* 4(GND)*; U2 A1(NC)* A2(NC)* A9(NC)* A10(NC)* B1(NC)* B9(NC)* B10(NC)* D6(NC)* D7(NC)* D8(NC)* E3(NC)* E4(NC)* E5(NC)* E6(NC)* E7(NC)* E8(NC)* F3(NC)* F4(NC)* F5(NC)* F6(NC)* F8(NC)* G3(DNU)* G5(LOCK)* G6(NC)* G7(NC)* G8(DNU)* H3(NC)* H5(NC)* H6(NC)* H7(NC)* J3(NC)* J5(NC)* L1(NC)* L2(NC)* L9(NC)* L10(NC)* M1(NC)* M2(NC)* M9(NC)* M10(NC)*; U6 1(NC)* 4(NC)* 5(NC)*; U15 8(RX_DV)* 11(RXD[2]/INT_N)* 12(RXD3/CLK_CTL)* 13(RXC)* 15(TXC)* 18(TXD[2])* 19(TXD[3])* 21(RESET_N)* 24(LEDO/PHYADDO)* 25(LED1/PHYADD1)* 27(COL)* 28(RX_ER)* 30(NC)*; U16 2(GND)* 4(GND)*; U17 3(PE4)* 4(PE5)* 5(PE6)* 6(VBAT)* 7(PI8)* 11(PI9)* 12(PI10)* 13(PI11)* 32(PC0)* 34(PC2)* 35(PC3)* 40(PA0-WKUP(PA0))* 41(PA1)* 43(PH2)* 44(PH3)* 47(PA3)* 50(PA4)* 51(PA5)* 52(PA6)* 56(PB0)* 57(PB1)* 59(PF11)* 60(PF12)* 63(PF13)* 64(PF14)* 65(PF15)* 66(PG0)* 67(PG1)* 74(PE11)* 75(PE12)* 76(PE13)* 77(PE14)* 78(PE15)* 79(PB10)* 83(PH6)* 84(PH7)* 85(PH8)* 86(PH9)* 87(PH10)* 88(PH11)* 89(PH12)* 92(PB12)* 93(PB13)* 94(PB14)* 95(PB15)* 96(PD8)* 97(PD9)* 98(PD10)* 101(PD13)* 106(PG2)* 107(PG3)* 108(PG4)* 109(PG5)* 110(PG6)* 111(PG7)* 112(PG8)* 115(PC6)* 116(PC7)* 119(PA8)* 120(PA9)* 121(PA10)* 122(PA11)* 123(PA12)* 128(PH13)* 129(PH14)* 130(PH15)* 131(PI0)* 132(PI1)* 133(PI2)* 134(PI3)* 138(PA15(JTDI))* 144(PD2)* 145(PD3)* 151(PD7)* 153(PG10)* 154(PG11)* 155(PG12)* 160(PG15)* 161(PB3(JTDO/TRACESWO))* 162(PB4(NJTRST))* 163(PB5)* 164(PB6)* 165(PB7)* 167(PB8)* 168(PB9)* 169(PE0)* 170(PE1)*

## Notes on the sheets
sheet 1
- 光学定位点
- 固定螺丝

# Board PCB
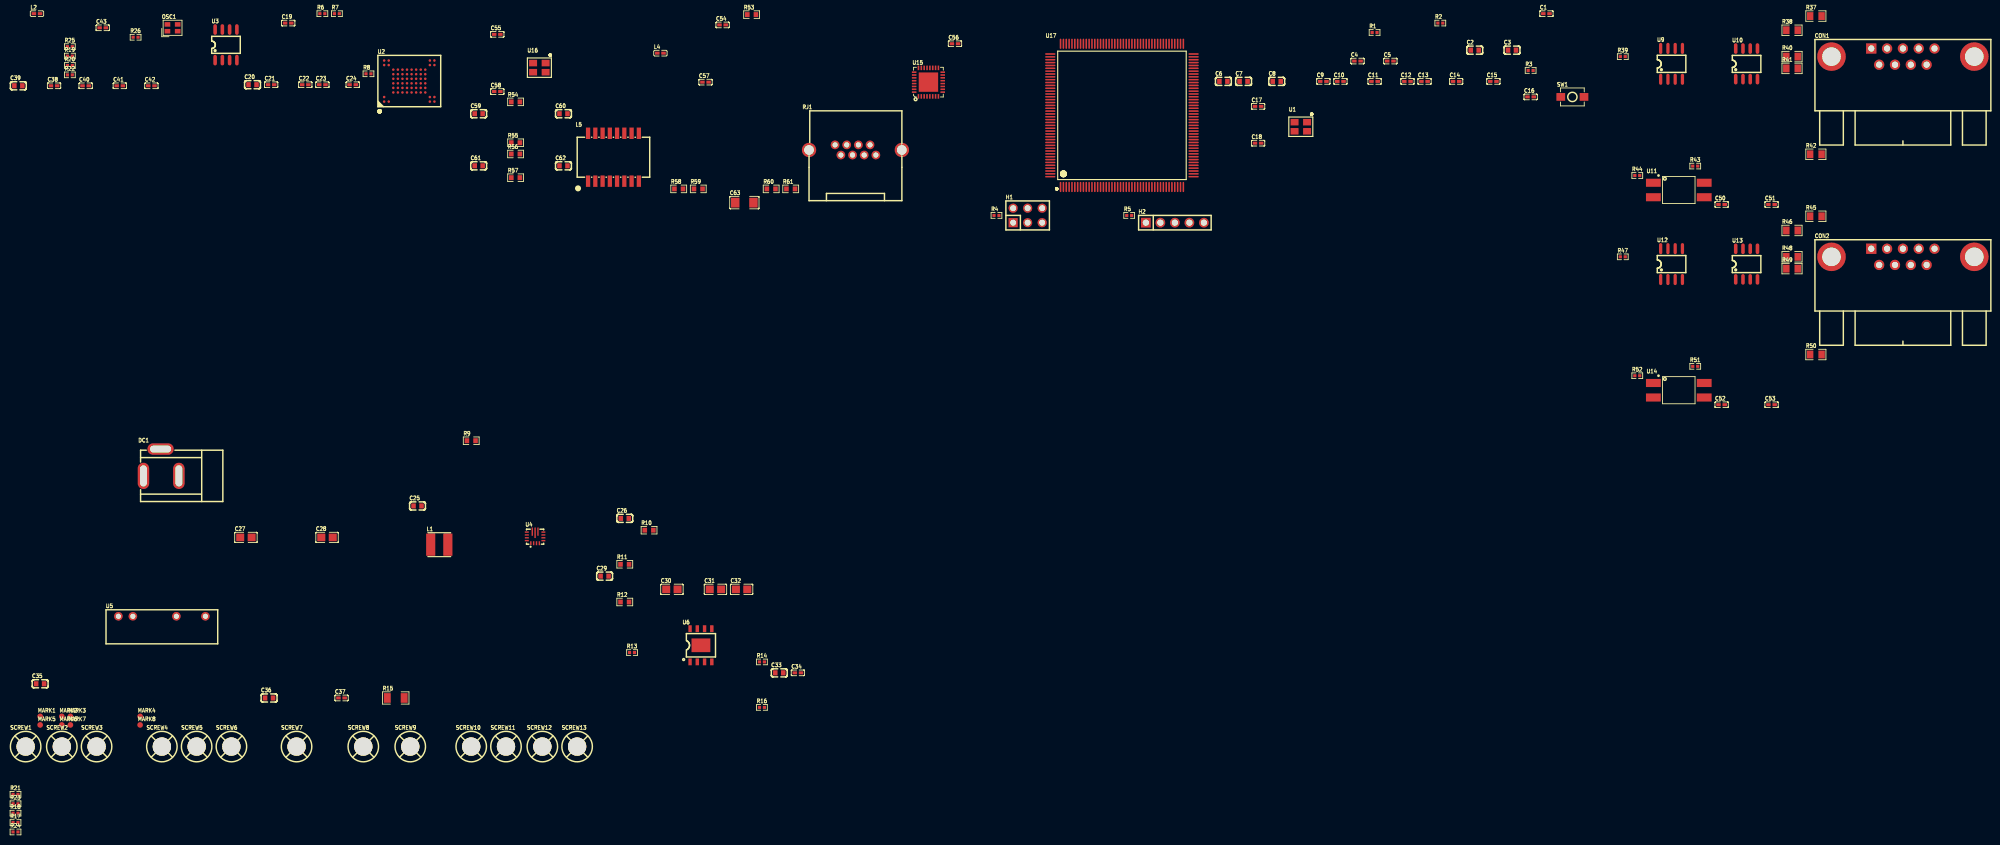
[diagram p6: board, top side]
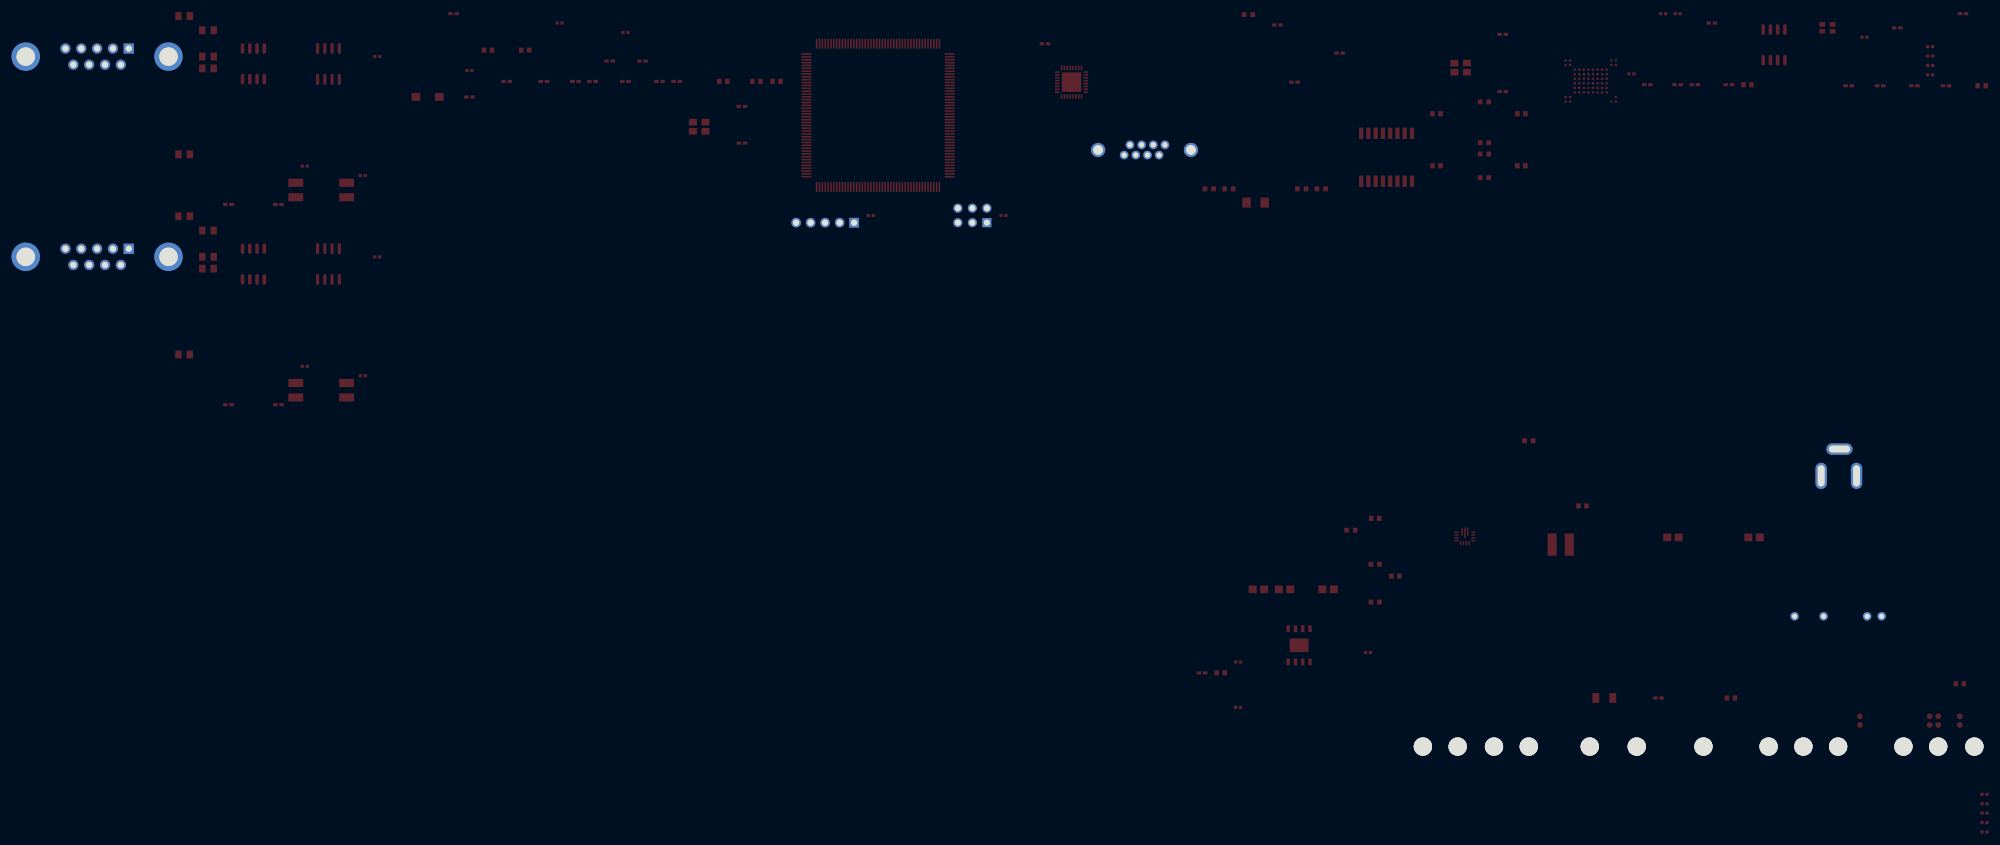
[diagram p7: board, bottom side, seen from below]

No outline. copper layers: Top Layer, Bottom Layer. Coordinates in mm from the lowest, leftmost part position.
Stack: Top Layer 0.035mm / Dielectric1 1.51mm FR4 er 4.5 / Bottom Layer 0.035mm

## Design rules (mm)
template: JLCPCB Capability(Two Layers Board)
spacing copperThickness1oz (default): track to track 0.102, other pairs 0.152 to 0.3
spacing copperThickness2oz: track to track 0.203, other pairs 0.152 to 0.3
track width copperThickness1oz (default): min 0.127, default 0.254, max 2.54
track width copperThickness2oz: min 0.203, default 0.254, max 2.54
differential pair differentialPair (default): width min 0.127, default 0.254, max 2.54; gap min 0.152, default 0.152
via viaSize (default): diameter min 0.5, default 0.61, max 10; hole min 0.3, default 0.305, max 6.3

## Placement (name value [footprint] x y rotation side)
C1  100nF  [C0402]  268.04 143.42 0 top
C2  10uF  [C0603]  255.49 137.03 0 top
C3  10uF  [C0603]  262.01 137.03 0 top
C4  2.2uF  [C0402]  234.96 135.11 0 top
C5  2.2uF  [C0402]  240.72 135.11 0 top
C6  10uF  [C0603]  211.48 131.55 0 top
C7  10uF  [C0603]  215.02 131.55 0 top
C8  10uF  [C0603]  220.82 131.55 0 top
C9  100nF  [C0402]  228.98 131.55 0 top
C10  100nF  [C0402]  231.97 131.55 0 top
C11  100nF  [C0402]  237.95 131.55 0 top
C12  100nF  [C0402]  243.71 131.55 0 top
C13  100nF  [C0402]  246.7 131.55 0 top
C14  100nF  [C0402]  252.23 131.55 0 top
C15  100nF  [C0402]  258.75 131.55 0 top
C16  100nF  [C0402]  265.27 128.83 0 top
C17  22pF  [C0402]  217.55 127.18 0 top
C18  22pF  [C0402]  217.55 120.72 0 top
C19  100nF  [C0402]  47.75 141.77 0 top
C20  10uF  [C0603]  41.5 130.97 0 top
C21  100nF  [C0402]  44.76 130.97 0 top
C22  100nF  [C0402]  50.74 130.97 0 top
C23  100nF  [C0402]  53.73 130.97 0 top
C24  100nF  [C0402]  59.03 130.97 0 top
C25  10uF  [C0603]  70.38 57.14 0 top
C26  100nF  [C0603]  106.67 54.97 0 top
C27  10uF  [C0805]  40.34 51.62 0 top
C28  10uF  [C0805]  54.54 51.62 0 top
C29  10uF  [C0603]  103.14 44.84 0 top
C30  10uF  [C0805]  114.93 42.52 0 top
C31  10uF  [C0805]  122.55 42.52 0 top
C32  10uF  [C0805]  127.13 42.52 0 top
C33  10uF  [C0603]  133.72 27.89 0 top
C34  100nF  [C0402]  136.99 27.89 0 top
C35  10uF  [C0603]  4.31 25.98 0 top
C36  10uF  [C0603]  44.4 23.49 0 top
C37  100nF  [C0402]  57.08 23.49 0 top
C38  ???  [C0402]  6.75 130.78 0 top
C39  10uF  [C0603]  0.5 130.78 0 top
C40  ???  [C0402]  12.28 130.78 0 top
C41  ???  [C0402]  18.26 130.78 0 top
C42  ???  [C0402]  23.79 130.78 0 top
C43  ???  [C0402]  15.27 140.94 0 top
C50  100nF  [C0402]  298.71 109.98 0 top
C51  100nF  [C0402]  307.46 109.98 0 top
C52  100nF  [C0402]  298.71 74.88 0 top
C53  100nF  [C0402]  307.46 74.88 0 top
C54  100nF  [C0402]  123.8 141.45 0 top
C55  22pF  [C0402]  84.35 139.8 0 top
C56  100nF  [C0402]  164.49 138.15 0 top
C57  100nF  [C0402]  120.81 131.42 0 top
C58  22pF  [C0402]  84.35 129.77 0 top
C59  100nF  [C0603]  81.09 125.88 0 top
C60  100nF  [C0603]  95.94 125.88 0 top
C61  100nF  [C0603]  81.09 116.75 0 top
C62  100nF  [C0603]  95.94 116.75 0 top
C63  1nF/2kV  [C1206]  127.61 110.3 0 top
CON1  DB9  [DB9-TH_DT10121-M5N3-4F]  330.45 135.89 0 top
CON2  DB9  [DB9-TH_DT10121-M5N3-4F]  330.45 100.8 0 top
DC1  -  [DC-005_2.5]  25.63 62.73 0 top
H1  -  [HDR-TH_6P-P2.54-V-R2-C3-S2.54_A2541WV-2X3P]  177.21 108.06 0 top
H2  -  [HDR-TH_5P-P2.54-V-M]  202.99 106.79 0 top
L1  1.5uH  [IND-SMD_L4.0-W4.0_FNR40XXS]  74.19 50.35 0 top
L2  10uH  [L0402]  3.76 143.42 0 top
L4  10uH  [L0402]  112.91 136.5 0 top
L5  H1102  [XFMR-SMD_H1102N]  104.69 118.26 0 top
MARK1  -  [Mark-Point-1mm]  4.31 20.26 0 top
MARK2  -  [Mark-Point-1mm]  8.11 20.26 0 top
MARK3  -  [Mark-Point-1mm]  9.61 20.26 0 top
MARK4  -  [Mark-Point-1mm]  21.82 20.26 0 top
MARK5  -  [Mark-Point-1mm]  4.31 18.76 0 top
MARK6  -  [Mark-Point-1mm]  8.11 18.76 0 top
MARK7  -  [Mark-Point-1mm]  9.61 18.76 0 top
MARK8  -  [Mark-Point-1mm]  21.82 18.76 0 top
OSC1  48MHz  [OSC-SMD_4P-L2.0-W1.6-BL]  27.5 140.94 0 top
R1  10K  [R0402]  237.95 140.12 0 top
R2  10R  [R0402]  249.46 141.77 0 top
R3  10K  [R0402]  265.27 133.46 0 top
R4  10K  [R0402]  171.75 108.06 0 top
R5  10K  [R0402]  194.99 108.06 0 top
R6  10K  [R0402]  53.73 143.42 0 top
R7  10K  [R0402]  56.27 143.42 0 top
R8  10K  [R0402]  61.8 132.88 0 top
R9  10K  [R0603]  79.79 68.57 0 top
R10  100K  [R0603]  110.92 52.89 0 top
R11  680K  [R0603]  106.67 46.92 0 top
R12  130K  [R0603]  106.67 40.31 0 top
R13  10K  [R0402]  107.94 31.45 0 top
R14  56K  [R0402]  130.69 29.8 0 top
R15  510R  [R1206]  66.57 23.49 0 top
R16  10K  [R0402]  130.69 21.84 0 top
R17  ???  [R0402]  0 1.65 0 top
R18  ???  [R0402]  0 3.3 0 top
R19  ???  [R0402]  9.51 135.99 0 top
R20  ???  [R0402]  9.51 134.34 0 top
R21  ???  [R0402]  0 6.6 0 top
R22  ???  [R0402]  9.51 132.69 0 top
R23  ???  [R0402]  0 4.95 0 top
R24  ???  [R0402]  0 0 0 top
R25  ???  [R0402]  9.51 137.64 0 top
R26  ???  [R0402]  21.02 139.29 0 top
R37  0R  [R0805]  315.21 143 0 top
R38  DNP  [R0805]  311.04 140.51 0 top
R39  22R  [R0402]  281.4 135.89 0 top
R40  DNP  [R0805]  311.04 135.89 0 top
R41  DNP  [R0805]  311.04 133.83 0 top
R42  0R  [R0805]  315.21 118.77 0 top
R43  4.7K  [R0402]  294.09 116.71 0 top
R44  330R  [R0402]  283.95 115.06 0 top
R45  0R  [R0805]  315.21 107.91 0 top
R46  DNP  [R0805]  311.04 105.42 0 top
R47  22R  [R0402]  281.4 100.8 0 top
R48  DNP  [R0805]  311.04 100.8 0 top
R49  DNP  [R0805]  311.04 98.73 0 top
R50  0R  [R0805]  315.21 83.68 0 top
R51  4.7K  [R0402]  294.09 81.61 0 top
R52  330R  [R0402]  283.95 79.96 0 top
R53  2.49K  [R0603]  128.88 143.26 0 top
R54  49.9R  [R0603]  87.56 127.96 0 top
R55  49.9R  [R0603]  87.56 120.8 0 top
R56  49.9R  [R0603]  87.56 118.83 0 top
R57  49.9R  [R0603]  87.56 114.68 0 top
R58  75R  [R0603]  116.12 112.71 0 top
R59  75R  [R0603]  119.54 112.71 0 top
R60  75R  [R0603]  132.3 112.71 0 top
R61  75R  [R0603]  135.73 112.71 0 top
RJ1  RJ45  [RJ45-TH_R-RJ45R10P-B000-1]  147.06 119.53 0 top
SCREW1  -  [M3螺丝]  1.77 14.97 0 top
SCREW2  -  [M3螺丝]  8.11 14.97 0 top
SCREW3  -  [M3螺丝]  14.2 14.97 0 top
SCREW4  -  [M3螺丝]  25.63 14.97 0 top
SCREW5  -  [M3螺丝]  31.71 14.97 0 top
SCREW6  -  [M3螺丝]  37.8 14.97 0 top
SCREW7  -  [M3螺丝]  49.21 14.97 0 top
SCREW8  -  [M3螺丝]  60.89 14.97 0 top
SCREW9  -  [M3螺丝]  69.11 14.97 0 top
SCREW10  -  [M3螺丝]  79.79 14.97 0 top
SCREW11  -  [M3螺丝]  85.88 14.97 0 top
SCREW12  -  [M3螺丝]  92.24 14.97 0 top
SCREW13  -  [M3螺丝]  98.33 14.97 0 top
SW1  -  [Key_SMD_3x4x2]  272.58 128.83 0 top
U1  25MHz  [CRYSTAL-SMD_4P-L3.2-W2.5-TR]  225.04 123.6 0 top
U2  MT29F4G08A  [VFBGA-63_L11.0-W9.0-P0.80-BL_MT29F2G08ABAEAH4-IT-E]  68.95 131.61 0 top
U3  24C02  [SOP-8_L4.9-W3.9-P1.27-LS6.0-BL]  36.85 137.96 0 top
U4  TPS63070R  [VQFN-HR-15_L3.0-W2.5-P0.50-BL_TPS63070RNMR]  90.97 51.62 0 top
U5  NMV0505SAC  [PWRM-TH_4P-L19.5-W6.0-P2.54_NMV0505SAC]  25.63 37.8 0 top
U6  RT9048  [ESOP-8_L4.9-W3.9-P1.27-LS6.0-BL-EP]  120.01 32.72 0 top
U9  ISO7221AD  [SOIC-8_L5.0-W4.0-P1.27-LS6.0-BL]  289.95 134.62 0 top
U10  RS485  [SOP-8_L4.9-W3.9-P1.27-LS6.0-BL]  303.08 134.62 0 top
U11  TLP781(GR-TP6,F)  [SOP-4_L6.5-W4.6-P2.54-LS10.3-TL]  291.22 112.52 0 top
U12  ISO7221AD  [SOIC-8_L5.0-W4.0-P1.27-LS6.0-BL]  289.95 99.53 0 top
U13  RS485  [SOP-8_L4.9-W3.9-P1.27-LS6.0-BL]  303.08 99.53 0 top
U14  TLP781(GR-TP6,F)  [SOP-4_L6.5-W4.6-P2.54-LS10.3-TL]  291.22 77.42 0 top
U15  YT8512C  [QFN-32_L5.0-W5.0-P0.50-BL-EP3.4]  159.84 131.42 0 top
U16  25MHz  [CRYSTAL-SMD_4P-L3.2-W2.5-TR]  91.72 133.96 0 top
U17  STM32F429IGT6  [LQFP-176_L24.0-W24.0-P0.50-LS26.0-BL]  193.72 125.6 0 top

## Footprints (pads in the part's own frame, mm; a bottom-side part is the same pattern mirrored in y, then rotated)
C0402
  rect 0.79x0.54 smd: 1(-0.545,0) 2(0.545,0)
C0603
  rect 0.8x0.9 smd: 1(-0.7,0) 2(0.7,0)
C0805
  rect 1.41x1.35 smd: 1(-1,0) 2(1,0)
C1206
  rect 1.485x1.728 smd: 1(-1.593,0) 2(1.593,0)
CRYSTAL-SMD_4P-L3.2-W2.5-TR
  rect 1.4x1.15 smd: 1(1.1,0.8) 2(-1.1,0.8) 3(-1.1,-0.8) 4(1.1,-0.8)
DB9-TH_DT10121-M5N3-4F
  rect 1.8x1.8 hole 1.1: 1(-5.54,1.42)
  round 1.8 hole 1.1: 2(-2.769,1.42) 3(0,1.42) 4(2.771,1.42) 5(5.54,1.42) 6(-4.155,-1.42) 7(-1.385,-1.42) 8(1.385,-1.42) 9(4.155,-1.42)
  round 5 hole 3.25: 10(-12.5,0) 11(12.5,0)
DC-005_2.5
  oval 2x4.6 hole 1.2x3.7: 1(-3.227,-0.318) 2(2.973,-0.318)
  oval 4.6x2 hole 3.7x1.2: 3(-0.227,4.382)
ESOP-8_L4.9-W3.9-P1.27-LS6.0-BL-EP
  rect 0.6x1.2 smd: 1(-1.905,-2.909) 2(-0.635,-2.909) 3(0.635,-2.909) 4(1.905,-2.909) 5(1.905,2.909) 6(0.635,2.909) 7(-0.635,2.909) 8(-1.905,2.909)
  rect 3.3x2.4 smd: 9(0,0)
HDR-TH_5P-P2.54-V-M
  rect 1.7x1.7 hole 1.1: 1(-5.08,0)
  round 1.7 hole 1.1: 2(-2.54,0) 3(0,0) 4(2.54,0) 5(5.08,0)
HDR-TH_6P-P2.54-V-R2-C3-S2.54_A2541WV-2X3P
  rect 1.6x1.6 hole 1.05: 1(-2.54,-1.27)
  round 1.6 hole 1.05: 2(-2.54,1.27) 3(0,-1.27) 4(0,1.27) 5(2.54,-1.27) 6(2.54,1.27)
IND-SMD_L4.0-W4.0_FNR40XXS
  rect 1.6x3.9 smd: 1(-1.5,0) 2(1.5,0)
Key_SMD_3x4x2
  rect 1.53x1.36 smd: 1(-2.035,0) 2(2.035,0)
L0402
  rect 0.79x0.54 smd: 1(-0.545,0) 2(0.545,0)
LQFP-176_L24.0-W24.0-P0.50-LS26.0-BL
  oval 0.28x1.8 smd: 1(-10.75,-12.55) 2(-10.25,-12.55) 3(-9.75,-12.55) 4(-9.25,-12.55) 5(-8.75,-12.55) 6(-8.25,-12.55) 7(-7.75,-12.55) 8(-7.25,-12.55) 9(-6.75,-12.55) 10(-6.25,-12.55) 11(-5.75,-12.55) 12(-5.25,-12.55) 13(-4.75,-12.55) 14(-4.25,-12.55) 15(-3.75,-12.55) 16(-3.25,-12.55) 17(-2.75,-12.55) 18(-2.25,-12.55) 19(-1.75,-12.55) 20(-1.25,-12.55) 21(-0.75,-12.55) 22(-0.25,-12.55) 23(0.25,-12.55) 24(0.75,-12.55) 25(1.25,-12.55) 26(1.75,-12.55) 27(2.25,-12.55) 28(2.75,-12.55) 29(3.25,-12.55) 30(3.75,-12.55) 31(4.25,-12.55) 32(4.75,-12.55) 33(5.25,-12.55) 34(5.75,-12.55) 35(6.25,-12.55) 36(6.75,-12.55) 37(7.25,-12.55) 38(7.75,-12.55) 39(8.25,-12.55) 40(8.75,-12.55) 41(9.25,-12.55) 42(9.75,-12.55) 43(10.25,-12.55) 44(10.75,-12.55) 89(10.75,12.55) 90(10.25,12.55) 91(9.75,12.55) 92(9.25,12.55) 93(8.75,12.55) 94(8.25,12.55) 95(7.75,12.55) 96(7.25,12.55) 97(6.75,12.55) 98(6.25,12.55) 99(5.75,12.55) 100(5.25,12.55) 101(4.75,12.55) 102(4.25,12.55) 103(3.75,12.55) 104(3.25,12.55) 105(2.75,12.55) 106(2.25,12.55) 107(1.75,12.55) 108(1.25,12.55) 109(0.75,12.55) 110(0.25,12.55) 111(-0.25,12.55) 112(-0.75,12.55) 113(-1.25,12.55) 114(-1.75,12.55) 115(-2.25,12.55) 116(-2.75,12.55) 117(-3.25,12.55) 118(-3.75,12.55) 119(-4.25,12.55) 120(-4.75,12.55) 121(-5.25,12.55) 122(-5.75,12.55) 123(-6.25,12.55) 124(-6.75,12.55) 125(-7.25,12.55) 126(-7.75,12.55) 127(-8.25,12.55) 128(-8.75,12.55) 129(-9.25,12.55) 130(-9.75,12.55) 131(-10.25,12.55) 132(-10.75,12.55)
  oval 1.8x0.28 smd: 45(12.55,-10.75) 46(12.55,-10.25) 47(12.55,-9.75) 48(12.55,-9.25) 49(12.55,-8.75) 50(12.55,-8.25) 51(12.55,-7.75) 52(12.55,-7.25) 53(12.55,-6.75) 54(12.55,-6.25) 55(12.55,-5.75) 56(12.55,-5.25) 57(12.55,-4.75) 58(12.55,-4.25) 59(12.55,-3.75) 60(12.55,-3.25) 61(12.55,-2.75) 62(12.55,-2.25) 63(12.55,-1.75) 64(12.55,-1.25) 65(12.55,-0.75) 66(12.55,-0.25) 67(12.55,0.25) 68(12.55,0.75) 69(12.55,1.25) 70(12.55,1.75) 71(12.55,2.25) 72(12.55,2.75) 73(12.55,3.25) 74(12.55,3.75) 75(12.55,4.25) 76(12.55,4.75) 77(12.55,5.25) 78(12.55,5.75) 79(12.55,6.25) 80(12.55,6.75) 81(12.55,7.25) 82(12.55,7.75) 83(12.55,8.25) 84(12.55,8.75) 85(12.55,9.25) 86(12.55,9.75) 87(12.55,10.25) 88(12.55,10.75) 133(-12.55,10.75) 134(-12.55,10.25) 135(-12.55,9.75) 136(-12.55,9.25) 137(-12.55,8.75) 138(-12.55,8.25) 139(-12.55,7.75) 140(-12.55,7.25) 141(-12.55,6.75) 142(-12.55,6.25) 143(-12.55,5.75) 144(-12.55,5.25) 145(-12.55,4.75) 146(-12.55,4.25) 147(-12.55,3.75) 148(-12.55,3.25) 149(-12.55,2.75) 150(-12.55,2.25) 151(-12.55,1.75) 152(-12.55,1.25) 153(-12.55,0.75) 154(-12.55,0.25) 155(-12.55,-0.25) 156(-12.55,-0.75) 157(-12.55,-1.25) 158(-12.55,-1.75) 159(-12.55,-2.25) 160(-12.55,-2.75) 161(-12.55,-3.25) 162(-12.55,-3.75) 163(-12.55,-4.25) 164(-12.55,-4.75) 165(-12.55,-5.25) 166(-12.55,-5.75) 167(-12.55,-6.25) 168(-12.55,-6.75) 169(-12.55,-7.25) 170(-12.55,-7.75) 171(-12.55,-8.25) 172(-12.55,-8.75) 173(-12.55,-9.25) 174(-12.55,-9.75) 175(-12.55,-10.25) 176(-12.55,-10.75)
M3螺丝
  round 3.2 hole 3.2: 1(0,0)
Mark-Point-1mm
  round 1 smd: 1(0,0)
OSC-SMD_4P-L2.0-W1.6-BL
  rect 1x0.8 smd: 1(-0.9,-0.6) 2(0.9,-0.6) 3(0.9,0.6) 4(-0.9,0.6)
PWRM-TH_4P-L19.5-W6.0-P2.54_NMV0505SAC
  round 1.5 hole 0.9: 1(-7.62,0) 2(-5.08,0) 5(2.54,0) 7(7.62,0)
QFN-32_L5.0-W5.0-P0.50-BL-EP3.4
  rect 0.28x0.8 smd: 1(-1.75,-2.5) 2(-1.252,-2.5) 3(-0.751,-2.5) 4(-0.252,-2.5) 5(0.248,-2.5) 6(0.749,-2.5) 7(1.248,-2.5) 8(1.748,-2.5) 17(1.752,2.5) 18(1.252,2.5) 19(0.751,2.5) 20(0.252,2.5) 21(-0.248,2.5) 22(-0.749,2.5) 23(-1.248,2.5) 24(-1.748,2.5)
  rect 0.8x0.28 smd: 9(2.5,-1.748) 10(2.5,-1.248) 11(2.5,-0.748) 12(2.5,-0.248) 13(2.5,0.252) 14(2.5,0.752) 15(2.5,1.252) 16(2.5,1.752) 25(-2.5,1.75) 26(-2.5,1.25) 27(-2.5,0.75) 28(-2.5,0.25) 29(-2.5,-0.25) 30(-2.5,-0.75) 31(-2.5,-1.25) 32(-2.5,-1.75)
  rect 3.4x3.4 smd: 33(0,0)
R0402
  rect 0.566x0.54 smd: 1(-0.433,0) 2(0.433,0)
R0603
  rect 0.806x0.864 smd: 1(-0.753,0) 2(0.753,0)
R0805
  rect 1.133x1.377 smd: 1(-1,0) 2(1,0)
R1206
  rect 1.208x1.701 smd: 1(-1.479,0) 2(1.479,0)
RJ45-TH_R-RJ45R10P-B000-1
  round 1.524 hole 0.914: 1(3.57,-0.89) 2(2.55,0.89) 3(1.53,-0.89) 4(0.51,0.89) 5(-0.51,-0.89) 6(-1.53,0.89) 7(-2.55,-0.89) 8(-3.57,0.89)
  round 2.5 hole 1.7: 9(8.125,0) 10(-8.125,0)
SOIC-8_L5.0-W4.0-P1.27-LS6.0-BL
  oval 0.569x1.95 smd: 1(-1.905,-2.705) 2(-0.635,-2.705) 3(0.635,-2.705) 4(1.905,-2.705) 5(1.905,2.705) 6(0.635,2.705) 7(-0.635,2.705) 8(-1.905,2.705)
SOP-4_L6.5-W4.6-P2.54-LS10.3-TL
  rect 2.6x1.423 smd: 1(-4.45,1.27) 2(-4.45,-1.27) 3(4.45,-1.27) 4(4.45,1.27)
SOP-8_L4.9-W3.9-P1.27-LS6.0-BL
  oval 0.63x1.865 smd: 1(-1.905,-2.683) 2(-0.635,-2.683) 3(0.635,-2.683) 4(1.905,-2.683) 5(1.905,2.683) 6(0.635,2.683) 7(-0.635,2.683) 8(-1.905,2.683)
VFBGA-63_L11.0-W9.0-P0.80-BL_MT29F2G08ABAEAH4-IT-E
  round 0.45 smd: A1(-4.4,-3.6) A2(-4.4,-2.8) A9(-4.4,2.8) A10(-4.4,3.6) B1(-3.6,-3.6) B9(-3.6,2.8) B10(-3.6,3.6) C3(-2.8,-2) C4(-2.8,-1.2) C5(-2.8,-0.4) C6(-2.8,0.4) C7(-2.8,1.2) C8(-2.8,2) D3(-2,-2) D4(-2,-1.2) D5(-2,-0.4) D6(-2,0.4) D7(-2,1.2) D8(-2,2) E3(-1.2,-2) E4(-1.2,-1.2) E5(-1.2,-0.4) E6(-1.2,0.4) E7(-1.2,1.2) E8(-1.2,2) F3(-0.4,-2) F4(-0.4,-1.2) F5(-0.4,-0.4) F6(-0.4,0.4) F7(-0.4,1.2) F8(-0.4,2) G3(0.4,-2) G4(0.4,-1.2) G5(0.4,-0.4) G6(0.4,0.4) G7(0.4,1.2) G8(0.4,2) H3(1.2,-2) H4(1.2,-1.2) H5(1.2,-0.4) H6(1.2,0.4) H7(1.2,1.2) H8(1.2,2) J3(2,-2) J4(2,-1.2) J5(2,-0.4) J6(2,0.4) J7(2,1.2) J8(2,2) K3(2.8,-2) K4(2.8,-1.2) K5(2.8,-0.4) K6(2.8,0.4) K7(2.8,1.2) K8(2.8,2) L1(3.6,-3.6) L2(3.6,-2.8) L9(3.6,2.8) L10(3.6,3.6) M1(4.4,-3.6) M2(4.4,-2.8) M9(4.4,2.8) M10(4.4,3.6)
VQFN-HR-15_L3.0-W2.5-P0.50-BL_TPS63070RNMR
  rect 0.25x0.7 smd: 1(-0.75,-1.016) 2(-0.25,-1.016) 3(0.25,-1.016) 4(0.75,-1.016)
  rect 0.7x0.25 smd: 5(1.45,-0.566) 6(1.45,-0.066) 7(1.45,0.434) 8(1.45,0.934) 12(-1.45,0.934) 13(-1.45,0.434) 14(-1.45,-0.066) 15(-1.45,-0.566)
  rect 0.25x1.45 smd: 9(0.5,1.016) 11(-0.5,1.016)
  rect 0.25x1.85 smd: 10(0,0.817)
XFMR-SMD_H1102N
  rect 0.75x2 smd: 1(-4.445,-4.2) 2(-3.175,-4.2) 3(-1.905,-4.2) 4(-0.635,-4.2) 5(0.635,-4.2) 6(1.905,-4.2) 7(3.175,-4.2) 8(4.445,-4.2) 9(4.445,4.2) 10(3.175,4.2) 11(1.905,4.2) 12(0.635,4.2) 13(-0.635,4.2) 14(-1.905,4.2) 15(-3.175,4.2) 16(-4.445,4.2)

## Nets
As in the schematic.

Pads without a net: C38 1 2; C39 1 2; C40 1 2; C41 1 2; C42 1 2; C43 1 2; CON1 1 2 4 7 9; CON2 1 2 4 7 9; L2 1 2; L5 4 5 12 13; MARK1 1; MARK2 1; MARK3 1; MARK4 1; MARK5 1; MARK6 1; MARK7 1; MARK8 1; OSC1 1 2 3 4; R17 1 2; R18 1 2; R19 1 2; R20 1 2; R21 1 2; R22 1 2; R23 1 2; R24 1 2; R25 1 2; R26 1 2; U1 2 4; U2 A1 A2 A9 A10 B1 B9 B10 D6 D7 D8 E3 E4 E5 E6 E7 E8 F3 F4 F5 F6 F8 G3 G5 G6 G7 G8 H3 H5 H6 H7 J3 J5 L1 L2 L9 L10 M1 M2 M9 M10; U6 1 4 5; U15 8 11 12 13 15 18 19 21 24 25 27 28 30; U16 2 4; U17 3 4 5 6 7 11 12 13 32 34 35 40 41 43 44 47 50 51 52 56 57 59 60 63 64 65 66 67 74 75 76 77 78 79 83 84 85 86 87 88 89 92 93 94 95 96 97 98 101 106 107 108 109 110 111 112 115 116 119 120 121 122 123 128 129 130 131 132 133 134 138 144 145 151 153 154 155 160 161 162 163 164 165 167 168 169 170
